# Altium project МЦТР.00010572.00.001.PrjPcb
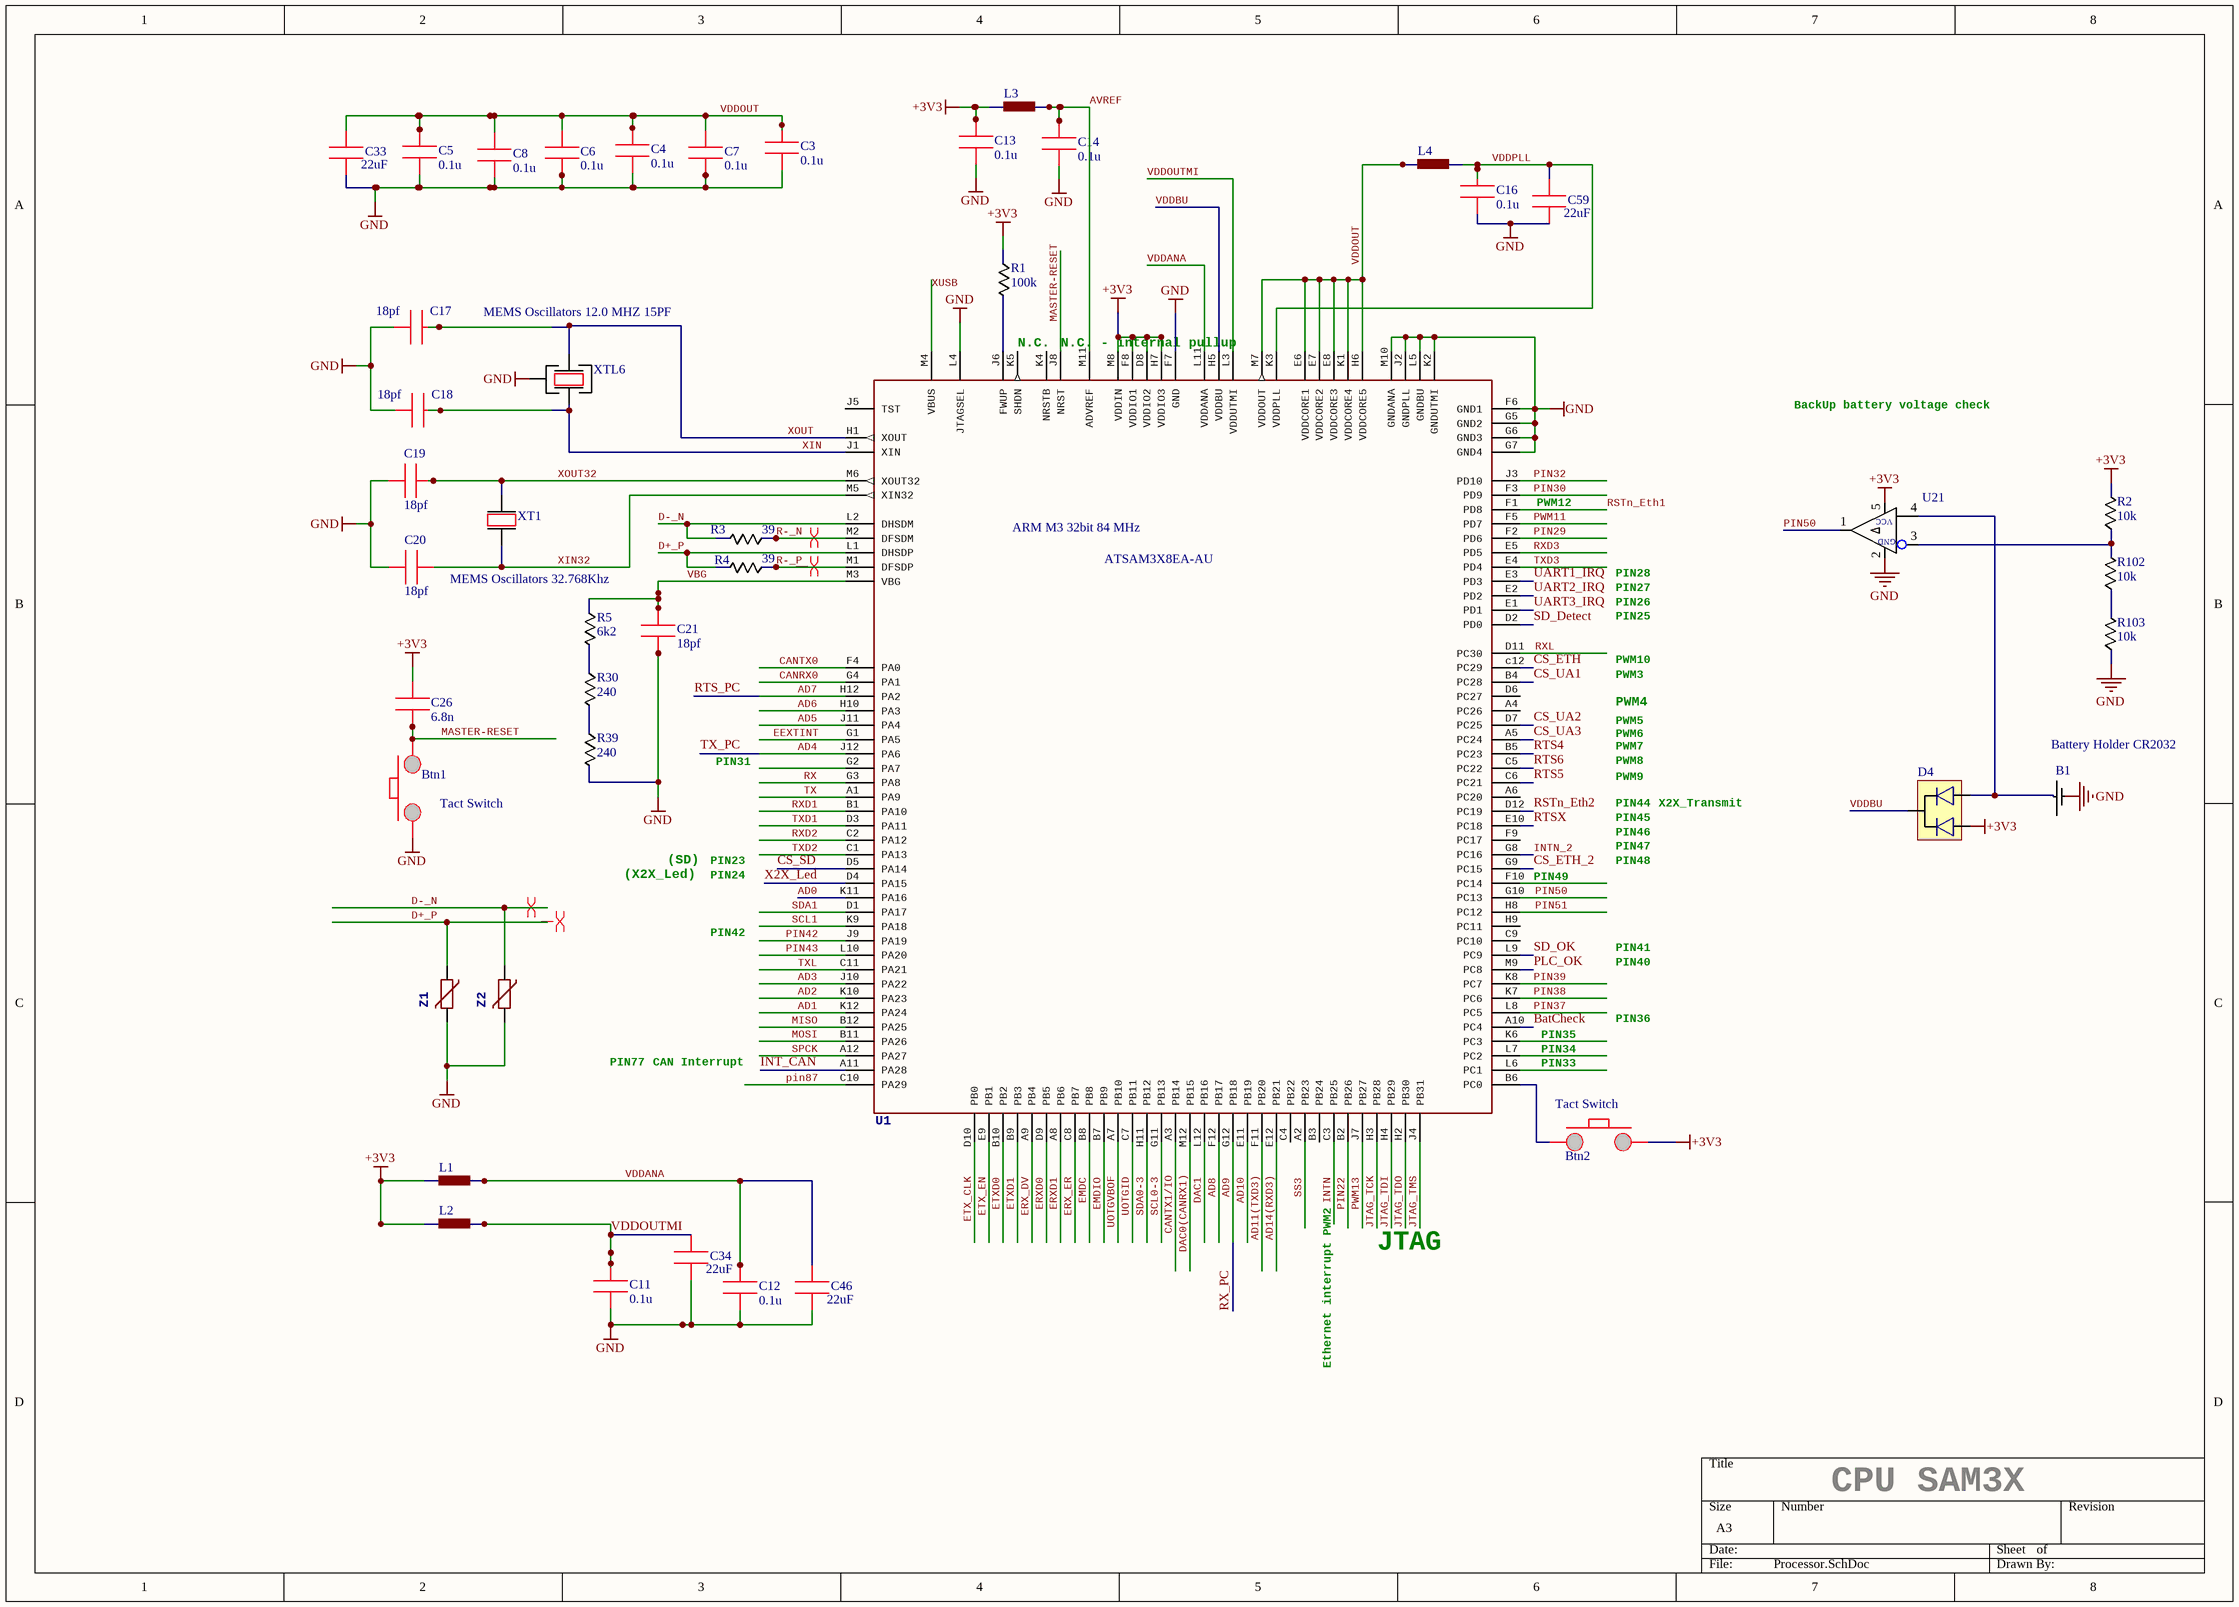
[diagram p0: Processor.SchDoc]
8 sheets, 286 parts. Net scope: global (net labels, ports and power ports of the same name join across sheets).
Board file: ÌÖÒÐ.00010572.00.001.PcbDoc
Sheets:
  Processor.SchDoc
  Power Supply.SchDoc
  LEDs.SchDoc
  Plugs.SchDoc
  Ethernet.SchDoc
  SD Holder.SchDoc
  RS485.SchDoc
  ETH_HMI.SchDoc

## Sheet Processor.SchDoc
size A3

### Parts
B1  Part Description: Battery Holder CR2032  [Batt Holder CR2032]
Btn1  (no value)  [Tact Switch]
Btn2  (no value)  [Tact Switch]
C3  0.1u  [0603]
C4  0.1u  [0603]
C5  0.1u  [0603]
C6  0.1u  [0603]
C7  0.1u  [0603]
C8  0.1u  [0603]
C11  0.1u  [0603]
C12  0.1u  [0603]
C13  0.1u  [0603]
C14  0.1u  [0603]
C16  0.1u  [0603]
C17  18pf  [0603]
C18  18pf  [0603]
C19  18pf  [0603]
C20  18pf  [0603]
C21  18pf  [0603]
C26  6.8n  [0603]
C33  22uF  [1206]
C34  22uF  [1206]
C46  22uF  [1206]
C59  22uF  [1206]
D4  (no value)  [SOT23]
L1  (no value)  [0805]
L2  (no value)  [0805]
L3  (no value)  [0805]
L4  (no value)  [0805]
R1  100k  [0603]
R2  10k  [0603]
R3  39  [0603]
R4  39  [0603]
R5  6k2  [0603]
R30  240  [0603]
R39  240  [0603]
R102  10k  [0603]
R103  10k  [0603]
U1  Part Description: ARM M3 32bit 84 MHz  Part Number: ATSAM3X8EA-AU  [LFBGA 144]
U21  (no value)  [SOT23 - 5 lead]
XT1  Part Description: MEMS Oscillators 32.768Khz  [KX – 327]
XTL6  Part Description: MEMS Oscillators 12.0 MHZ 15PF  [KX-7 XTAL]
Z1  (no value)  [0603]
Z2  (no value)  [0603]

### Nets
+3V3: Btn2.1 C13.2 C26.2 D4.1 L1.1 L2.1 L3.1 R1.1 R2.2 U1.D8(VDDIO2) U1.F8(VDDIO1) U1.H7(VDDIO3) U1.M8(VDDIN) U21.5
GND: B1.0 Btn1.0 C3.1 C4.1 C5.1 C6.1 C7.1 C8.1 C11.1 C12.1 C13.1 C14.1 C16.1 C17.1 C18.1 C19.2 C20.2 C21.1 C33.1 C34.1 C46.1 C59.1 R39.2 R103.1 U1.F6(GND1) U1.F7(GND) U1.G5(GND2) U1.G6(GND3) U1.G7(GND4) U1.J2(GNDPLL) U1.K2(GNDUTMI) U1.L4(JTAGSEL) U1.L5(GNDBU) U1.M10(GNDANA) U21.2 XTL6.2 Z1.2 Z2.2
AD0: U1.K11(PA16)
AD1: U1.K12(PA24)
AD2: U1.K10(PA23)
AD3: U1.J10(PA22)
AD4: U1.J12(PA6)  [also labelled TX_PC]
AD5: U1.J11(PA4)
AD6: U1.H10(PA3)
AD7: U1.H12(PA2)  [also labelled RTS_PC]
AD8: U1.F12(PB17)
AD9: U1.G12(PB18)  [also labelled RX_PC]
AD10: U1.E11(PB19)
AD11(TXD3): U1.F11(PB20)
AD14(RXD3): U1.E12(PB21)
AVREF: C14.2 L3.2 U1.M11(ADVREF)
BatCheck: U1.A10(PC4)
CANRX0: U1.G4(PA1)
CANTX0: U1.F4(PA0)
CANTX1/IO: U1.A3(PB14)
CS_ETH: U1.c12(PC29)
CS_ETH_2: U1.G9(PC15)
CS_SD: U1.D5(PA14)
CS_UA1: U1.B4(PC28)
CS_UA2: U1.D7(PC25)
CS_UA3: U1.A5(PC24)
D+_P: R4.2 U1.L1(DHSDP) Z1.1
D-_N: R3.2 U1.L2(DHSDM) Z2.1
DAC0(CANRX1): U1.M12(PB15)
DAC1: U1.L12(PB16)
EEXTINT: U1.G1(PA5)
EMDC: U1.B8(PB8)
EMDIO: U1.B7(PB9)
ERX_DV: U1.A9(PB4)
ERX_ER: U1.C8(PB7)
ERXD0: U1.D9(PB5)
ERXD1: U1.A8(PB6)
ETX_CLK: U1.D10(PB0)
ETX_EN: U1.E9(PB1)
ETXD0: U1.B10(PB2)
ETXD1: U1.B9(PB3)
INT_CAN: U1.A11(PA28)
INTN: U1.C3(PB25)
INTN_2: U1.G8(PC16)
JTAG_TCK: U1.H3(PB28)
JTAG_TDI: U1.H4(PB29)
JTAG_TDO: U1.H2(PB30)
JTAG_TMS: U1.J4(PB31)
MASTER-RESET: Btn1.1 C26.1 U1.J8(NRST)
MISO: U1.B12(PA25)
MOSI: U1.B11(PA26)
PIN22: U1.B2(PB26)
PIN29: U1.F2(PD6)
PIN30: U1.F3(PD9)
PIN32: U1.J3(PD10)
PIN37: U1.L8(PC5)
PIN38: U1.K7(PC6)
PIN39: U1.K8(PC7)
PIN42: U1.J9(PA19)
PIN43: U1.L10(PA20)
PIN50: U1.G10(PC13) U21.1
PIN51: U1.H8(PC12)
pin87: U1.C10(PA29)
PLC_OK: U1.M9(PC8)
PWM11: U1.F5(PD7)
PWM13: U1.J7(PB27)
R-_N: R3.1 U1.M2(DFSDM)
R-_P: R4.1 U1.M1(DFSDP)
RSTn_Eth1: U1.F1(PD8)
RSTn_Eth2: U1.D12(PC19)
RTS4: U1.B5(PC23)
RTS5: U1.C6(PC21)
RTS6: U1.C5(PC22)
RTSX: U1.E10(PC18)
RX: U1.G3(PA8)
RXD1: U1.B1(PA10)
RXD2: U1.C2(PA12)
RXD3: U1.E5(PD5)
RXL: U1.D11(PC30)
SCL0-3: U1.G11(PB13)
SCL1: U1.K9(PA18)
SD_Detect: U1.D2(PD0)
SD_OK: U1.L9(PC9)
SDA0-3: U1.H11(PB12)
SDA1: U1.D1(PA17)
SPCK: U1.A12(PA27)
SS3: U1.A2(PB23)
TX: U1.A1(PA9)
TXD1: U1.D3(PA11)
TXD2: U1.C1(PA13)
TXD3: U1.E4(PD4)
TXL: U1.C11(PA21)
UART1_IRQ: U1.E3(PD3)
UART2_IRQ: U1.E2(PD2)
UART3_IRQ: U1.E1(PD1)
UOTGID: U1.C7(PB11)
UOTGVBOF: U1.A7(PB10)
VBG: C21.2 R5.1 U1.M3(VBG)
VDDANA: C12.2 C46.2 L1.2 U1.L11(VDDANA)
VDDBU: D4.3 U1.H5(VDDBU)
VDDOUT: C3.2 C4.2 C5.2 C6.2 C7.2 C8.2 C33.2 L4.1 U1.E6(VDDCORE1) U1.E7(VDDCORE2) U1.E8(VDDCORE3) U1.H6(VDDCORE5) U1.K1(VDDCORE4) U1.M7(VDDOUT)
VDDOUTMI: C11.2 C34.2 L2.2 U1.L3(VDDUTMI)
VDDPLL: C16.2 C59.2 L4.2 U1.K3(VDDPLL)
X2X_Led: U1.D4(PA15)
XIN: C18.2 U1.J1(XIN) XTL6.3
XIN32: C20.1 U1.M5(XIN32) XT1.1
XOUT: C17.2 U1.H1(XOUT) XTL6.1
XOUT32: C19.1 U1.M6(XOUT32) XT1.2
XUSB: U1.M4(VBUS)
NetB1_1: B1.1 D4.2 U21.4
NetBtn2_0: Btn2.0 U1.B6(PC0)
NetR1_2: R1.2 U1.J6(FWUP)
NetR2_1: R2.1 R102.2 U21.3
NetR5_2: R5.2 R30.1
NetR30_2: R30.2 R39.1
NetR102_1: R102.1 R103.2

Not connected (* = marked no-connect by the designer): U1 A4(PC26) A6(PC20) B3(PB24) C4(PB22) C9(PC10) D6(PC27) F9(PC17) F10(PC14) G2(PA7) H9(PC11) J5(TST) K4(NRSTB) K5(SHDN) K6(PC3) L6(PC1) L7(PC2)

### Layout directives
differential pair: (no net found under the mark)

### Notes on the sheet
- N.C.
- (near U1) N.C. - internal pullup
- BackUp battery voltage check
- (near U1) PWM12
- PIN28
- PIN27
- PIN26
- PIN25
- PWM3
- PWM10
- PIN31
- PWM5
- PWM6
- PWM7
- PWM8
- PWM4
- PWM9
- PIN44
- PIN46
- PIN45
- X2X_Transmit
- (X2X_Led)
- (SD)
- PIN23
- PIN24
- (near U1) PIN49
- PIN47
- PIN48
- PIN42
- PIN41
- PIN40
- (near U1) PIN35
- (near U1) PIN34
- PIN36
- PIN77
- CAN Interrupt
- PIN33
- PWM2
- JTAG
- Ethernet interrupt
- CPU SAM3X
- (in symbol TS391ILT) VCC; GND

### Library data of the parts
B1 = Batt Holder CR2032: Part Number: 1734178-1
Btn1 Btn2 = Tact Switch: Part Number: KLS7-TS6606-4.3-180; Part Description: Tact Switch
C3-C8 C11-C14 C16 = Capasitor 0805: Part Description: 0.1 uF 100 VDC 10% 0603 X7R; Part Number: GRM188R72A104KA35D
C17-C21 = Capasitor 0805: Part Description: 18 pF 50 VDC 5% 0603 C0G; Part Number: GRM1885C1H180JA01D
C26 = 0603 CAP: Part Description: 50V 6800pF X7R 0603 10%; Part Number: CC0603KRX7R9BB682
C33 C34 C46 C59 = 0805 Cap: Part Description: 16V 22uF X5R 1206; Part Number: CC1206KKX5R7BB226
D4 = BAT54C: Part Description: Schottky Diodes & Rectifiers Schottky, SOT-23, 30V, 0.2A; Part Number: BAT54C
L1-L4 = BLM21PG220SN1D: Part Description: Ferrite Beads 1000 OHM 25%  100 MHz; Part Number: BLM41PG102SN1L
R1 = Resistor 0805: Part Description: Resistor 0603, 100kOhms, 1%, 1/10W; Part Number: RC0603FR-07100KL
R2 R102 R103 = Resistor 0805: Part Description: Resistor 0603, 10kOhms, 5%, 1/10W; Part Number: RC0603JR-0710K
R3 R4 = Resistor 0805: Part Description: Resistor 0603, 39Ohms, 1%, 1/10W; Part Number: RC0603FR-0739RL
R5 = Resistor 0805: Part Description: Resistor 0603, 6.2kOhms, 5%, 1/10W; Part Number: RC0603JR-076K2L
R30 R39 = Resistor 0805: Part Description: Resistor 0603, 240Ohms, 1%, 1/10W; Part Number: RC0603FR-07240RL
U1 = ATSAM3X/AAU
U21 = TS391ILT: Part Description: Analog Comparators Lo-Pwr Sngl Voltage; Part Number: TS391ILT
XT1 = KX – 327XS: Part Number: KX – 327XS
XTL6 = KX-7: Part Number: Geyer KX-7 12.0 MHz
Z1 Z2 = VARISTORCN0603: Part Description: Chip Guard 0603 5 Volts; Part Number: CG0603MLC-05E

## Sheet Power Supply.SchDoc
size A4
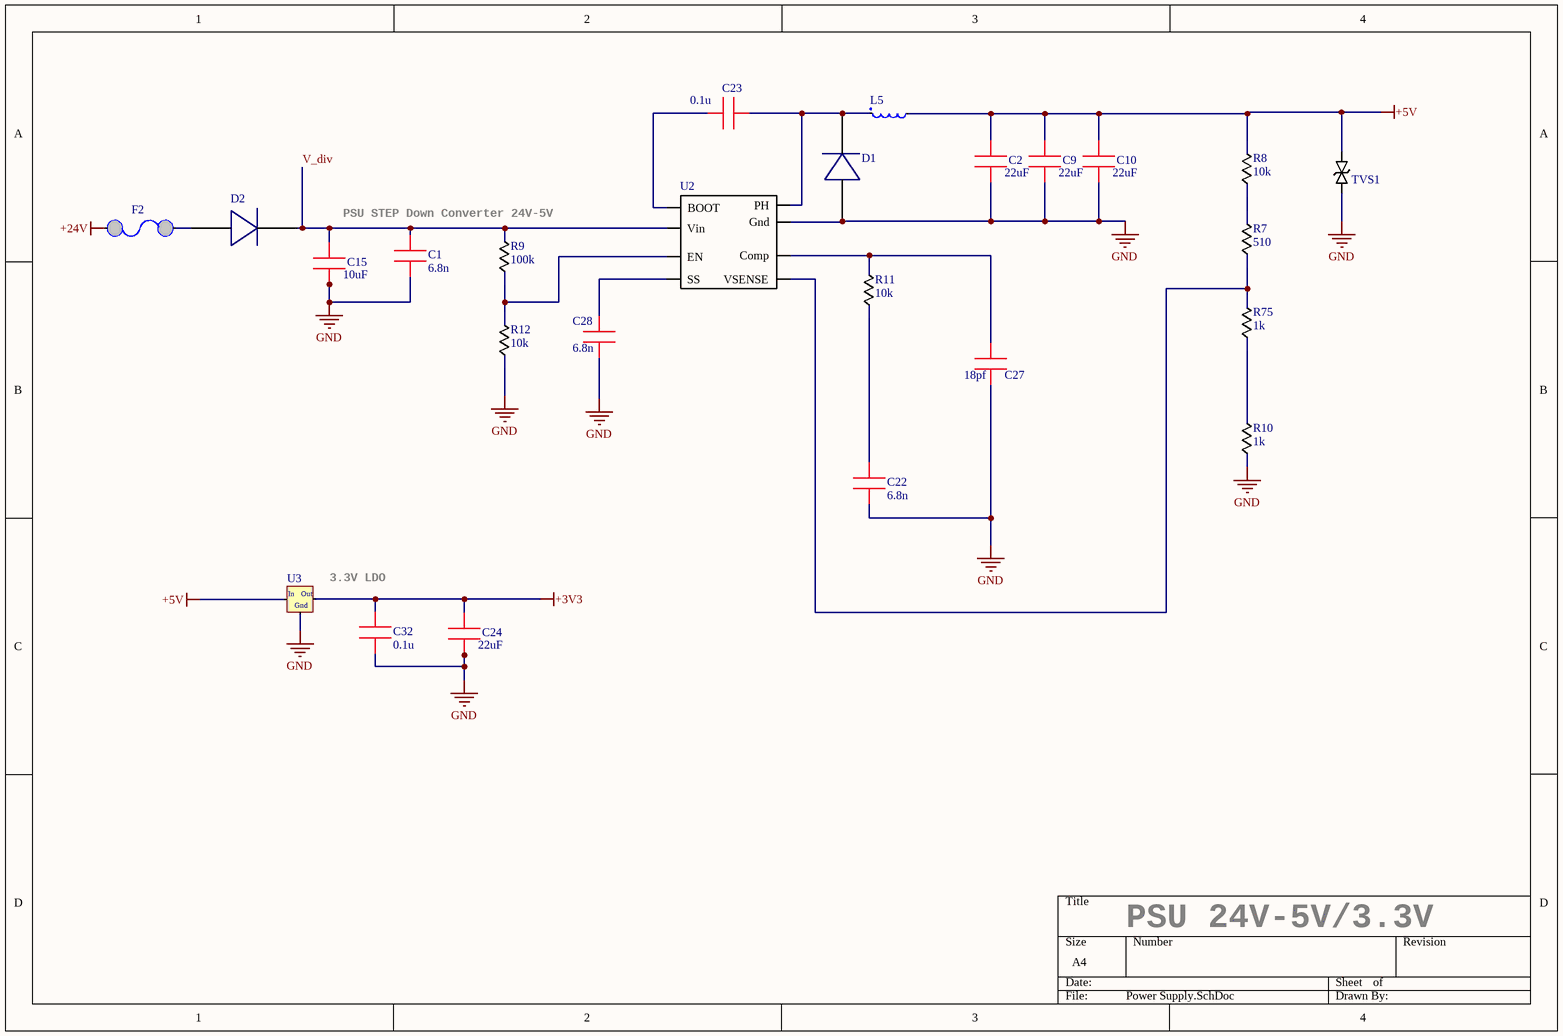
[diagram p1: Power Supply.SchDoc]

### Parts
C1  6.8n  [0603]
C2  22uF  [1206]
C9  22uF  [1206]
C10  22uF  [1206]
C15  10uF  [1206]
C22  6.8n  [0603]
C23  0.1u  [0603]
C24  22uF  [1206]
C27  18pf  [0603]
C28  6.8n  [0603]
C32  0.1u  [0603]
D1  (no value)  [B340A-13-F]
D2  (no value)  [B340A-13-F]
F2  (no value)  [Fuse PTS]
L5  (no value)  [CDRH127/LDNP-270MC,]
R7  510  [0603]
R8  10k  [0603]
R9  100k  [0603]
R10  1k  [0603]
R11  10k  [0603]
R12  10k  [0603]
R75  1k  [0603]
TVS1  (no value)  [DO-214AC]
U2  (no value)  [SOIC 8]
U3  (no value)  [SOT223]

### Nets
+3V3: C24.2 C32.1 U3.2(OUT)
+5V: C2.2 C9.2 C10.2 L5.2 R8.2 TVS1.2 U3.3(IN)
+24V: F2.2
GND: C1.1 C2.1 C9.1 C10.1 C15.1 C22.1 C24.1 C27.1 C28.1 C32.2 D1.2 R10.1 R12.1 TVS1.1 U2.7(Gnd) U3.1(GND)
V_div: C1.2 C15.2 D2.1 R9.2 U2.2(Vin)
NetC22_2: C22.2 R11.1
NetC23_1: C23.1 U2.1(BOOT)
NetC23_2: C23.2 D1.1 L5.1 U2.8(PH)
NetC27_2: C27.2 R11.2 U2.6(Comp)
NetC28_2: C28.2 U2.4(SS)
NetD2_2: D2.2 F2.1
NetR7_1: R7.1 R75.2 U2.5(VSENSE)
NetR7_2: R7.2 R8.1
NetR9_1: R9.1 R12.2 U2.3(EN)
NetR10_2: R10.2 R75.1

### Notes on the sheet
- PSU STEP Down Converter 24V-5V
- (near U3) 3.3V LDO
- PSU 24V-5V/3.3V
- (in symbol NCV1117ST50T3G) In; Out; Gnd

### Library data of the parts
C1 C22 = 0603 CAP: as C26 on sheet Processor
C2 C9 C10 C24 = 0805 Cap: as C33 on sheet Processor
C15 = 0805 Cap: Part Description: 10UF 50V 10% 1206; Part Number: GRM31CR61H106KA12L
C23 = 0805 Cap: Part Description: 0.1 uF 100 VDC 10% 0603 X7R; Part Number: GRM188R72A104KA35D
C27 = 0805 Cap: Part Description: 18 pF 50 VDC 5% 0603 C0G; Part Number: GRM1885C1H180JA01D
C28 = 0805 Cap: Part Description: 50V 6800pF X7R 0603 10%; Part Number: CC0603KRX7R9BB682
C32 = Capasitor 0805: as C3 on sheet Processor
D1 D2 = B340A-13-F: Part Description: Schottky Diodes & Rectifiers 60V 3A; Part Number: B360A-13-F
F2 = Fuse PTS: Part Description: PPTC 30V 300MA; Part Number: MF-MSMF030-2
L5 = CDRH127/LDNP-270MC: Part Description: Power Inductors - SMD 22uH 4.7A; Part Number: CDRH127/LDNP-220MC
R7 = Resistor 0805: Part Description: Resistor 0603, 510Ohms, 5%, 1/10W; Part Number: RC0603JR-07510RL
R8 R11 R12 = Resistor 0805: as R2 on sheet Processor
R9 = 0603 RES: Part Description: Resistor 0603, 100kOhms, 1%, 1/10W; Part Number: RC0603FR-07100KL
R10 R75 = Resistor 0805: Part Description: Resistor 0603, 1kOhms, 5%, 1/10W; Part Number: RC0603JR-071KL
TVS1 = TVS: Part Number: SMAJ5.0CA; Part Description: ESD Protection Diodes 5V
U2 = TPS54331: Part Description: Switching Voltage Regulators 3A 28V In Step Down; Part Number: TPS54331DR
U3 = NCV1117ST50T3G: Part Description: LDO Voltage Regulators 800MA 3.3V; Part Number: LM1117MPX-3.3

## Sheet LEDs.SchDoc
size A4
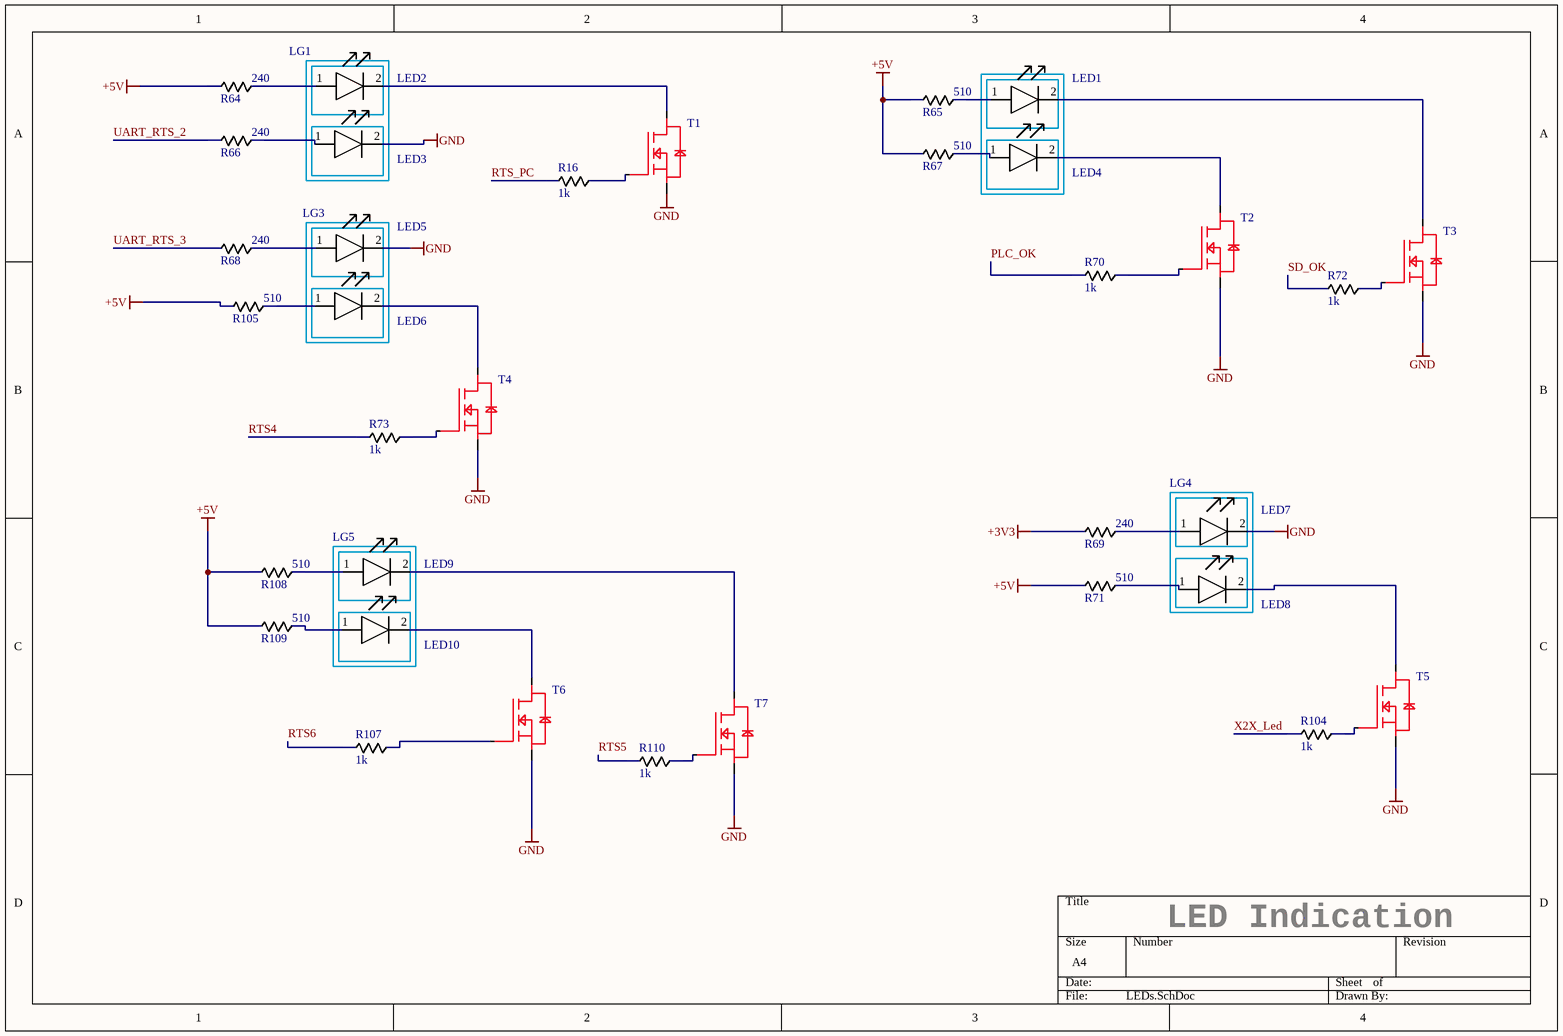
[diagram p2: LEDs.SchDoc]

### Parts
LED1  (no value)  [0603 - LED]
LED2  (no value)  [0603 - LED]
LED3  (no value)  [0603 - LED]
LED4  (no value)  [0603 - LED]
LED5  (no value)  [0603 - LED]
LED6  (no value)  [0603 - LED]
LED7  (no value)  [0603 - LED]
LED8  (no value)  [0603 - LED]
LED9  (no value)  [0603 - LED]
LED10  (no value)  [0603 - LED]
LG1  (no value)  [LED SMD DayLight]
LG2  (no value)  [LED SMD DayLight]
LG3  1k  [LED SMD DayLight]  (value not drawn)
LG4  (no value)  [LED SMD DayLight]
LG5  (no value)  [LED SMD DayLight]
R16  1k  [0603]
R64  240  [0603]
R65  510  [0603]
R66  240  [0603]
R67  510  [0603]
R68  240  [0603]
R69  240  [0603]
R70  1k  [0603]
R71  510  [0603]
R72  1k  [0603]
R73  1k  [0603]
R104  1k  [0603]
R105  510  [0603]
R107  1k  [0603]
R108  510  [0603]
R109  510  [0603]
R110  1k  [0603]
T1  (no value)  [SOT23]
T2  (no value)  [SOT23]
T3  (no value)  [SOT23]
T4  (no value)  [SOT23]
T5  (no value)  [SOT23]
T6  (no value)  [SOT23]
T7  (no value)  [SOT23]

### Nets
+3V3: R69.2
+5V: R64.2 R65.2 R67.2 R71.2 R105.2 R108.2 R109.2
GND: LED3.2 LED5.2 LED7.2 T1.2 T2.2 T3.2 T4.2 T5.2 T6.2 T7.2
PLC_OK: R70.2
RTS4: R73.2
RTS5: R110.2
RTS6: R107.2
RTS_PC: R16.2  [project net AD7]
SD_OK: R72.2
UART_RTS_2: R66.2
UART_RTS_3: R68.2
X2X_Led: R104.2
NetLED1_1: LED1.1 R65.1
NetLED1_2: LED1.2 T3.3
NetLED2_1: LED2.1 R64.1
NetLED2_2: LED2.2 T1.3
NetLED3_1: LED3.1 R66.1
NetLED4_1: LED4.1 R67.1
NetLED4_2: LED4.2 T2.3
NetLED5_1: LED5.1 R68.1
NetLED6_1: LED6.1 R105.1
NetLED6_2: LED6.2 T4.3
NetLED7_1: LED7.1 R69.1
NetLED8_1: LED8.1 R71.1
NetLED8_2: LED8.2 T5.3
NetLED9_1: LED9.1 R108.1
NetLED9_2: LED9.2 T7.3
NetLED10_1: LED10.1 R109.1
NetLED10_2: LED10.2 T6.3
NetR16_1: R16.1 T1.1
NetR70_1: R70.1 T2.1
NetR72_1: R72.1 T3.1
NetR73_1: R73.1 T4.1
NetR104_1: R104.1 T5.1
NetR107_1: R107.1 T6.1
NetR110_1: R110.1 T7.1

### Notes on the sheet
- LED Indication

### Library data of the parts
LED1 LED4 LED7 LED8 = LED 0603: Part Number: KP-1608SGC; Part Description: 0603 Single Colour LED Green
LED2 LED3 LED5 LED6 LED9 LED10 = LED 0603: Part Number: KP-1608SYC; Part Description: 0603 Single Colour LED Yellow
LG1 LG2 LG4 LG5 = Light Guide 2: Part Number: 5151094F; Part Description: Light Guide
LG3 = Light Guide 2: Part Number: RC0603FR-071KL; Part Description: Thick Film Resistor - 0603, 1kOhms, 1%, 1/10W
R16 R70 R72 R73 R104 R107 R110 = Resistor 0805: as R10 on sheet Power Supply
R64 R66 R68 R69 = Resistor 0805: as R30 on sheet Processor
R65 R67 R71 R105 R108 R109 = Resistor 0805: as R7 on sheet Power Supply
T1-T7 = IRLML2402: Part Description: MOSFETs SOT-23 N-CH LOGIC; Part Number: BSS138

## Sheet Plugs.SchDoc
size A4
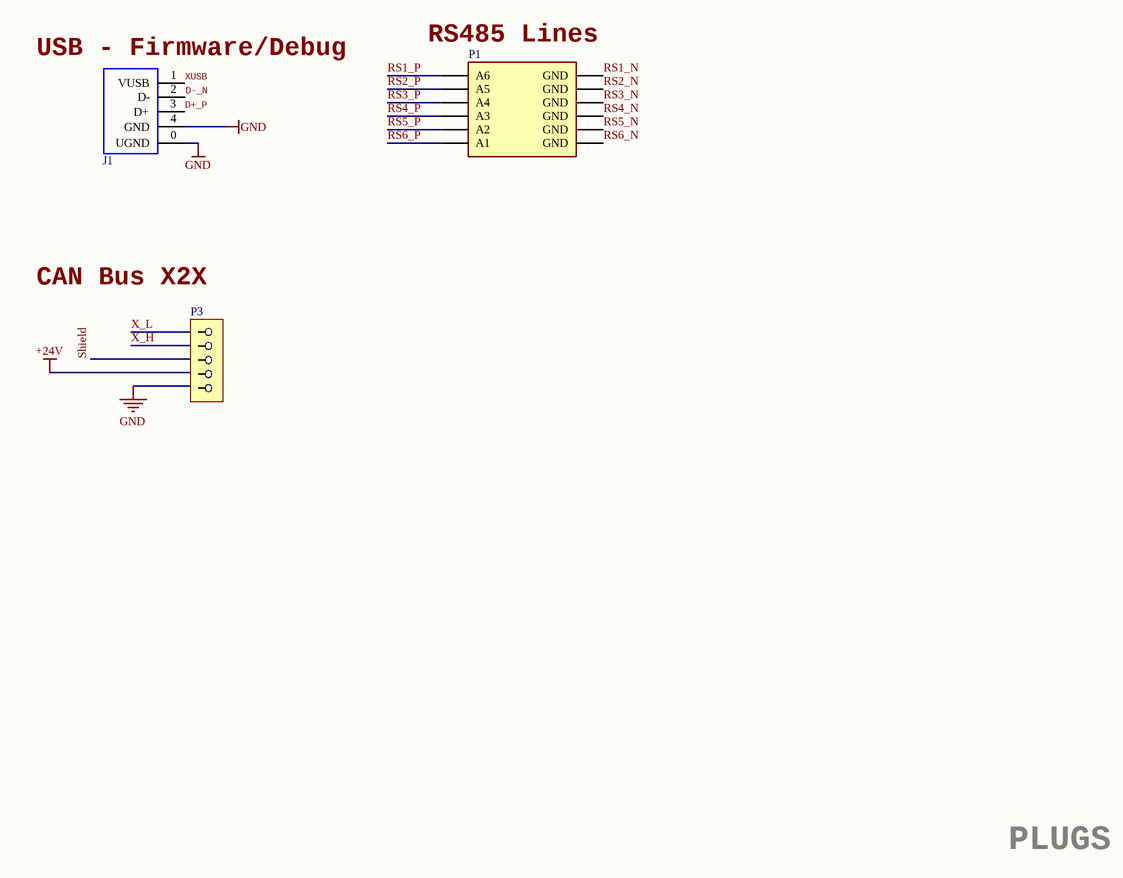
[diagram p3: Plugs.SchDoc]

### Parts
J1  (no value)  [USB B]
P1  (no value)  [mcd 1,5/6-G1-3.81]
P3  (no value)  [PhClass5]

### Nets
+24V: P3.4
GND: J1.0(UGND) J1.4(GND) P3.5
D+_P: J1.3(D+)
D-_N: J1.2(D-)
RS1_N: P1.2(GND)
RS1_P: P1.1(A6)
RS2_N: P1.4(GND)
RS2_P: P1.3(A5)
RS3_N: P1.6(GND)
RS3_P: P1.5(A4)
RS4_N: P1.8(GND)
RS4_P: P1.7(A3)
RS5_N: P1.10(GND)
RS5_P: P1.9(A2)
RS6_N: P1.12(GND)
RS6_P: P1.11(A1)
Shield: P3.3
X_H: P3.2
X_L: P3.1
XUSB: J1.1(VUSB)

### Notes on the sheet
- (near J1) USB - Firmware/Debug
- (near P1) RS485 Lines
- (near P3) CAN Bus X2X
- PLUGS

### Library data of the parts
J1 = USBB-1J: Part Description: USB B Socket; Part Number: USBB-1J
P1 = Header 6X2: Part Description: PCB Header, 6-Pin, Dual row; Part Number: MCD 1.5/6-G1-3.81
P3 = EMSTBA 2.5/5-G-5.08: Part Description: PCB header; Part Number: EMSTBA 2.5/5-G-5.08

## Sheet Ethernet.SchDoc
size A3
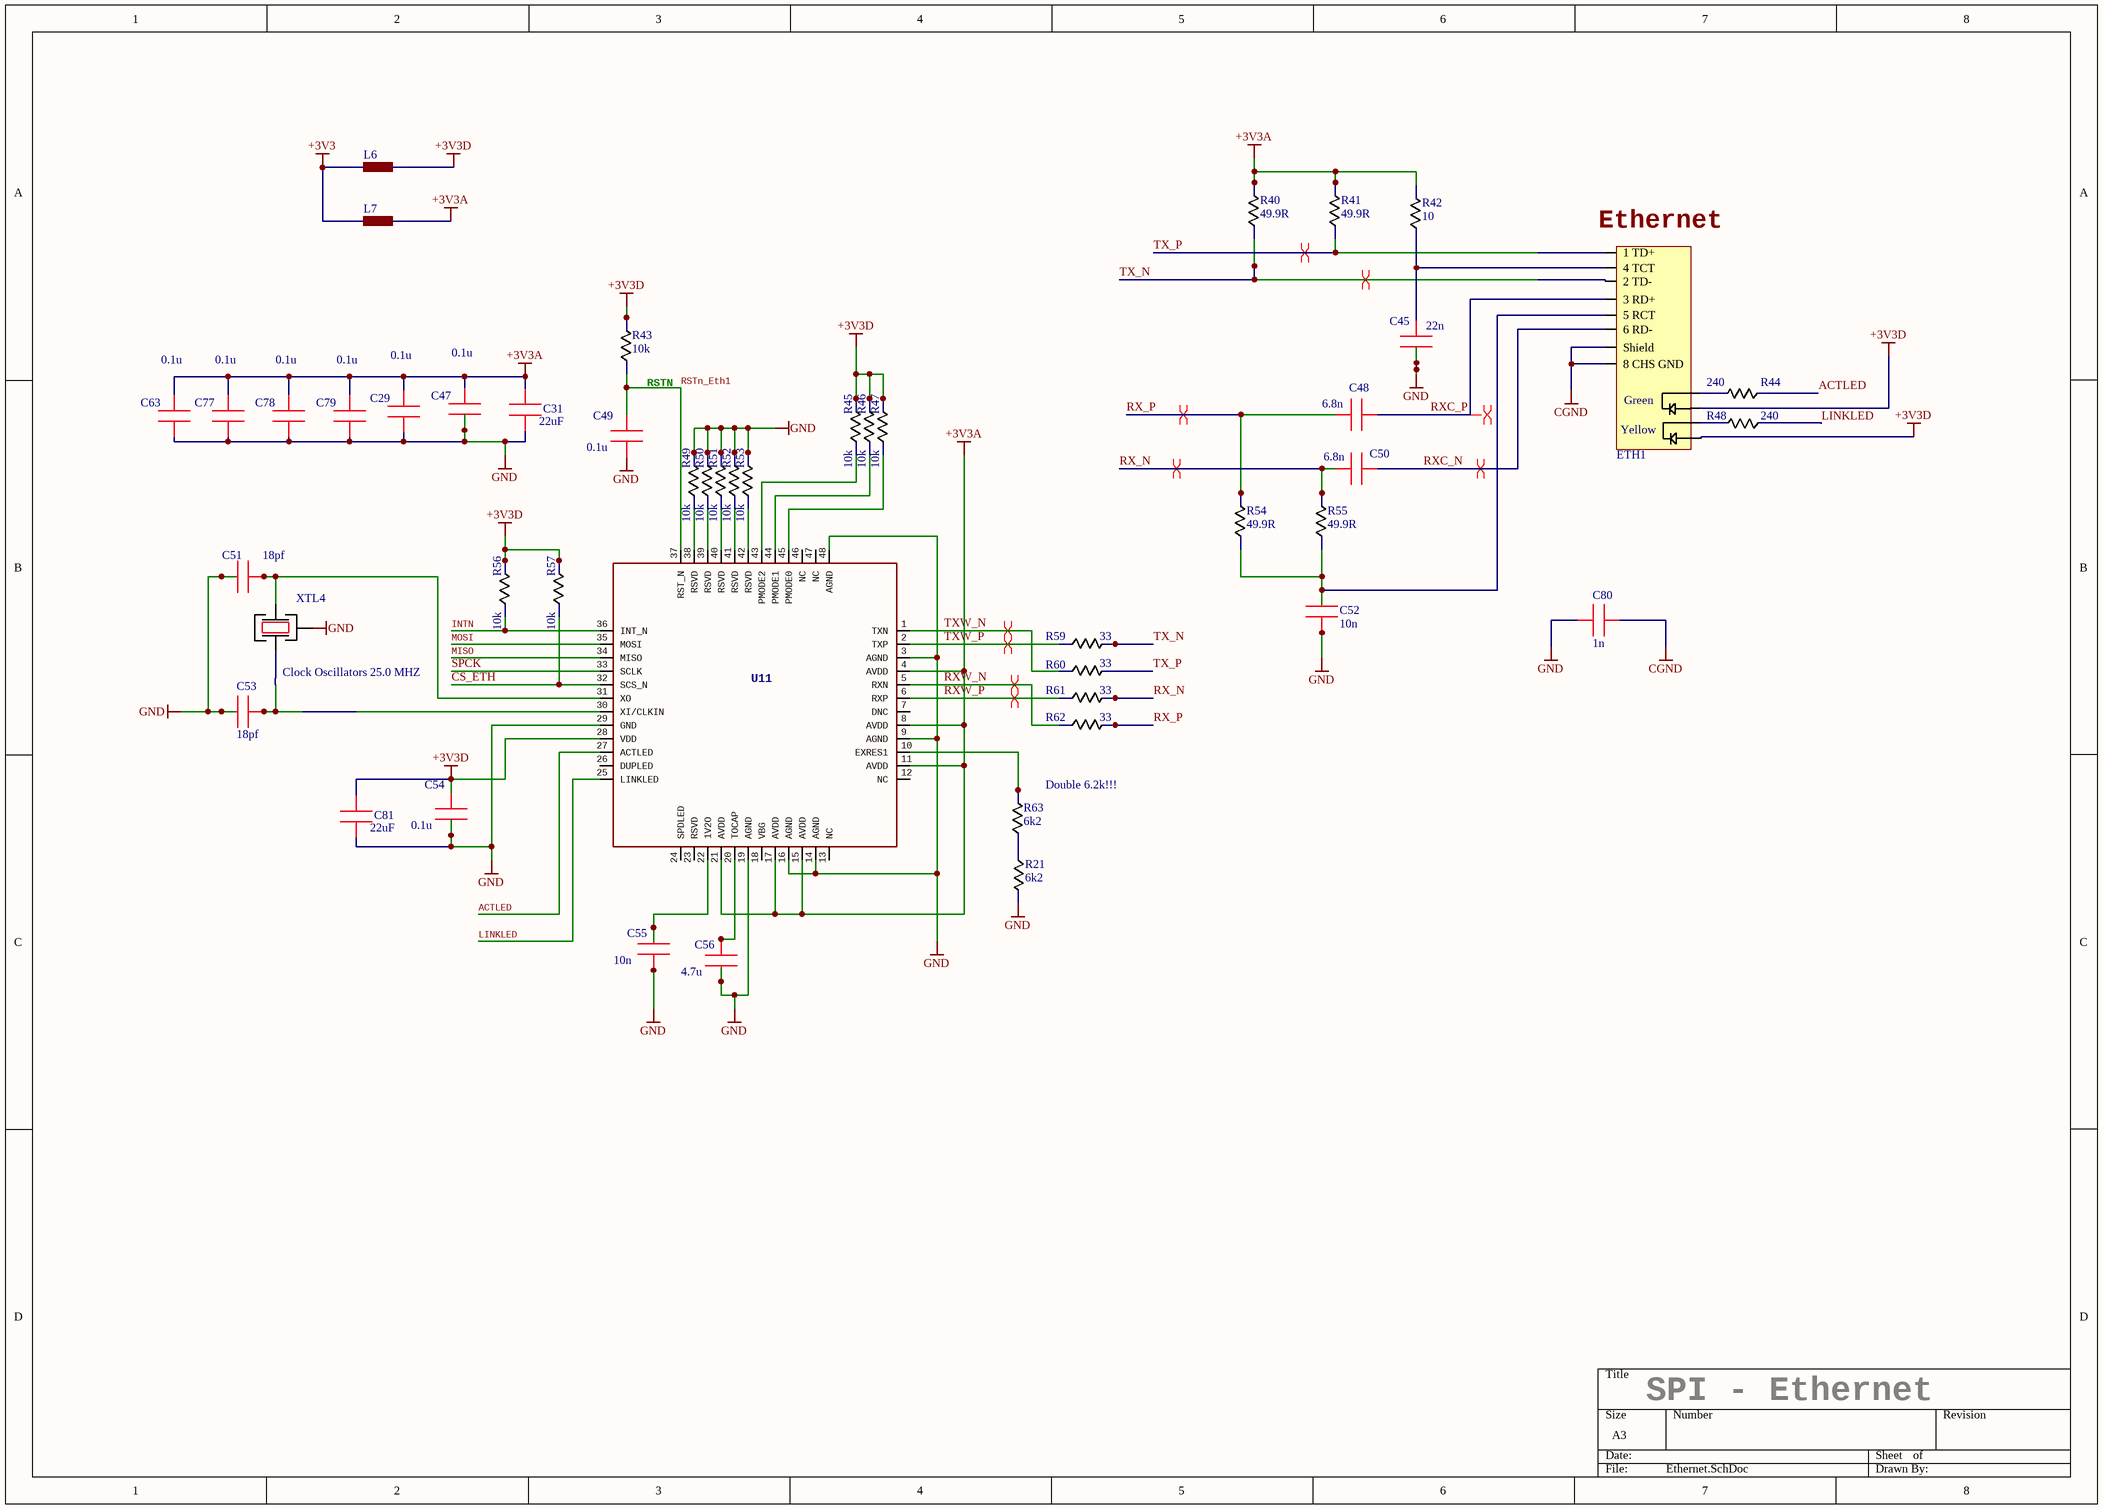
[diagram p4: Ethernet.SchDoc]

### Parts
C29  0.1u  [0603]
C31  22uF  [1206]
C45  22n  [0603]
C47  0.1u  [0603]
C48  6.8n  [0603]
C49  0.1u  [0603]
C50  6.8n  [0603]
C51  18pf  [0603]
C52  10n  [0603]
C53  18pf  [0603]
C54  0.1u  [0603]
C55  10n  [0603]
C56  4.7u  [0603]
C63  0.1u  [0603]
C77  0.1u  [0603]
C78  0.1u  [0603]
C79  0.1u  [0603]
C80  1n  [1206]
C81  22uF  [1206]
ETH1  (no value)  [RJ45]
L6  (no value)  [0805]
L7  (no value)  [0805]
R21  6k2  [0603]
R40  49.9R  [0603]
R41  49.9R  [0603]
R42  10  [0603]
R43  10k  [0603]
R44  240  [0603]
R45  10k  [0603]
R46  10k  [0603]
R47  10k  [0603]
R48  240  [0603]
R49  10k  [0603]
R50  10k  [0603]
R51  10k  [0603]
R52  10k  [0603]
R53  10k  [0603]
R54  49.9R  [0603]
R55  49.9R  [0603]
R56  10k  [0603]
R57  10k  [0603]
R59  33  [0603]
R60  33  [0603]
R61  33  [0603]
R62  33  [0603]
R63  6k2  [0603]
U11  (no value)  [LQFP 48]
XTL4  Part Description: Clock Oscillators 25.0 MHZ  [KX-7 XTAL]

### Nets
+3V3: L6.1 L7.1
+3V3A: C29.1 C31.2 C47.1 C63.1 C77.1 C78.1 C79.1 L7.2 R40.2 R41.2 R42.2 U11.4(AVDD) U11.8(AVDD) U11.11(AVDD) U11.15(AVDD) U11.17(AVDD) U11.21(AVDD)
+3V3D: C54.1 C81.2 ETH1.9(LDGr) ETH1.12(LDYE) L6.2 R43.2 R45.2 R46.2 R47.2 R56.2 R57.2 U11.28(VDD)
CGND: C80.2 ETH1.8(8_CHS_GND) ETH1.SHIELD(Shield)
GND: C29.2 C31.1 C45.2 C47.2 C49.2 C51.1 C52.2 C53.1 C54.2 C55.2 C56.2 C63.2 C77.2 C78.2 C79.2 C80.1 C81.1 R21.2 R49.2 R50.2 R51.2 R52.2 R53.2 U11.3(AGND) U11.9(AGND) U11.14(AGND) U11.16(AGND) U11.19(AGND) U11.29(GND) U11.48(AGND) XTL4.2
ACTLED: R44.1 U11.27(ACTLED)
CS_ETH: R57.1 U11.32(SCS_N)
INTN: R56.1 U11.36(INT_N)
LINKLED: R48.1 U11.25(LINKLED)
MISO: U11.34(MISO)
MOSI: U11.35(MOSI)
RSTn_Eth1: C49.1 R43.1 U11.37(RST_N)
RX_N: C50.1 R55.2 R61.2
RX_P: C48.1 R54.2 R62.2
RXC_N: C50.2 ETH1.6(6_RD-)
RXC_P: C48.2 ETH1.3(3_RD+)
RXW_N: R62.1 U11.5(RXN)
RXW_P: R61.1 U11.6(RXP)
SPCK: U11.33(SCLK)
TX_N: ETH1.2(2_TD-) R40.1 R59.2
TX_P: ETH1.1(1_TD+) R41.1 R60.2
TXW_N: R60.1 U11.1(TXN)
TXW_P: R59.1 U11.2(TXP)
NetC45_1: C45.1 ETH1.4(4_TCT) R42.1
NetC51_2: C51.2 U11.31(XO) XTL4.3
NetC52_1: C52.1 ETH1.5(5_RCT) R54.1 R55.1
NetC53_2: C53.2 U11.30(XI/CLKIN) XTL4.1
NetC55_1: C55.1 U11.22(1V2O)
NetC56_1: C56.1 U11.20(TOCAP)
NetETH1_10: ETH1.10(LDGr) R44.2
NetETH1_11: ETH1.11(LDYE) R48.2
NetR21_1: R21.1 R63.1
NetR45_1: R45.1 U11.43(PMODE2)
NetR46_1: R46.1 U11.44(PMODE1)
NetR47_1: R47.1 U11.45(PMODE0)
NetR49_1: R49.1 U11.38(RSVD)
NetR50_1: R50.1 U11.39(RSVD)
NetR51_1: R51.1 U11.40(RSVD)
NetR52_1: R52.1 U11.41(RSVD)
NetR53_1: R53.1 U11.42(RSVD)
NetR63_2: R63.2 U11.10(EXRES1)

Not connected (* = marked no-connect by the designer): U11 7(DNC) 12(NC) 13(NC) 18(VBG) 23(RSVD) 24(SPDLED) 26(DUPLED) 46(NC) 47(NC)

### Layout directives
differential pair: RX_N, RX_P, RXC_N, RXC_P, RXW_N, RXW_P, TX_N, TX_P, TXW_N, TXW_P

### Notes on the sheet
- (near ETH1) Ethernet
- (near R43) RSTN
- (near R63) Double 6.2k!!!
- SPI - Ethernet
- (in symbol J0011D21BNL) Green; Yellow

### Library data of the parts
C29 C47 C49 C54 C63 C77-C79 = 0603 CAP: Part Description: 0.1 uF 100 VDC 10% 0603 X7R; Part Number: GRM188R72A104KA35D
C31 C81 = 0805 Cap: Part Description: 16V 22uF X5R 1206 10%; Part Number: CC1206KKX5R7BB226
C45 = 0603 CAP: Part Description: 0.022UF 50V 10% 0603; Part Number: GRM188R71H223KA01D
C48 C50 = 0603 CAP: as C26 on sheet Processor
C51 C53 = 0603 CAP: Part Description: 18 pF 50 VDC 5% 0603 C0G; Part Number: GRM1885C1H180JA01D
C52 C55 = 0603 CAP: Part Description: 50V 0.01uF X7R 0603 5%; Part Number: CC0603JRX7R9BB103
C56 = 0603 CAP: Part Description: 16V 4.7uF X5R 0603 10%; Part Number: CC0603KRX5R7BB475
C80 = 0603 CAP: Part Description: 2kV 1000pF X7R 1206 10%; Part Number: CC1206KKX7RDBB102
ETH1 = J0011D21BNL: Part Description: RJ45 MagJack; Part Number: J0011D21BNL
L6 L7 = BLM21PG220SN1D: as L1 on sheet Processor
R21 = Resistor 0805: as R5 on sheet Processor
R40 R41 R54 R55 = 0603 RES: Part Description: Resistor 0603, 49.9Ohms, 1%, 1/10W; Part Number: RC0603FR-0749R9
R42 = 0603 RES: Part Description: Resistors - 1/8 Watt 10ohms 1%; Part Number: CRCW060310R0FKEA
R43 R45-R47 R49-R53 R56 R57 = 0603 RES: Part Description: Resistor 0603, 10kOhms, 5%, 1/10W; Part Number: RC0603JR-0710K
R44 R48 = 0603 RES: Part Description: Resistor 0603, 240Ohms, 1%, 1/10W; Part Number: RC0603FR-07240RL
R59-R62 = 0603 RES: Part Description: Resistor 0603, 33Ohms, 1%, 1/10W; Part Number: RC0603FR-0733RL
R63 = 0603 RES: Part Description: Resistor 0603, 6.2kOhms, 5%, 1/10W; Part Number: RC0603JR-076K2L
U11 = W5500: Part Description: Ethernet ICs 3in1 Enet Controller TCP/IP +MAC+PHY; Part Number: W5500
XTL4 = KX-7: Part Number: Geyer KX-7 25.0 MHz

## Sheet SD Holder.SchDoc
size A4
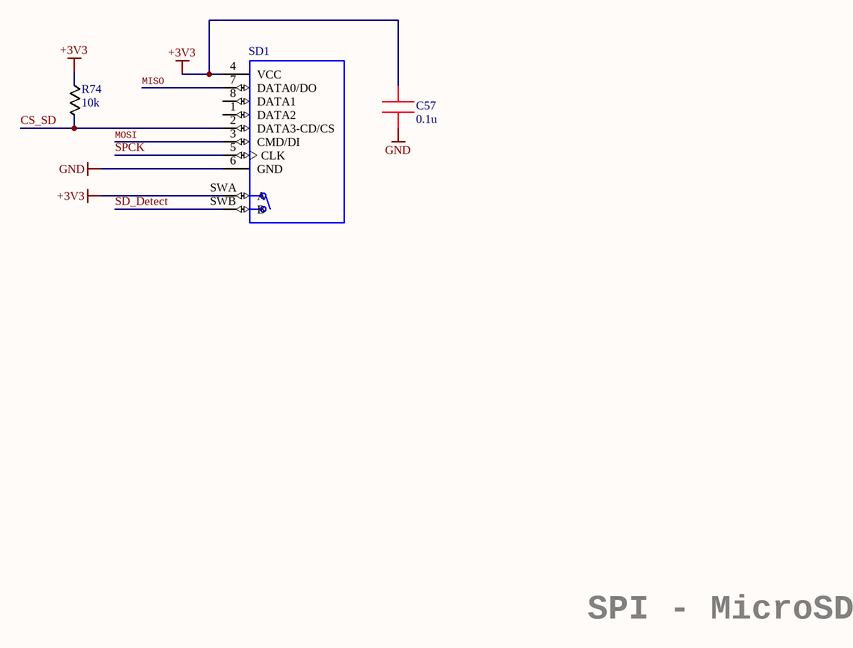
[diagram p5: SD Holder.SchDoc]

### Parts
C57  0.1u  [0603]
R74  10k  [0603]
SD1  (no value)  [DM3AT-SF-PEJM5]

### Nets
+3V3: C57.2 R74.1 SD1.4(VCC) SD1.SWA(A)
GND: C57.1 SD1.6(GND)
CS_SD: R74.2 SD1.2(DATA3-CD/CS)
MISO: SD1.7(DATA0/DO)
MOSI: SD1.3(CMD/DI)
SD_Detect: SD1.SWB(B)
SPCK: SD1.5(CLK)

Not connected (* = marked no-connect by the designer): SD1 1(DATA2) 8(DATA1)

### Notes on the sheet
- SPI - MicroSD

### Library data of the parts
C57 = 0603 CAP: as C29 on sheet Ethernet
R74 = 0603 RES: as R43 on sheet Ethernet
SD1 = DM3AT-SF-PEJM5: Part Description: uSD card holder; Part Number: DM3AT-SF-PEJM5

## Sheet RS485.SchDoc
size A3
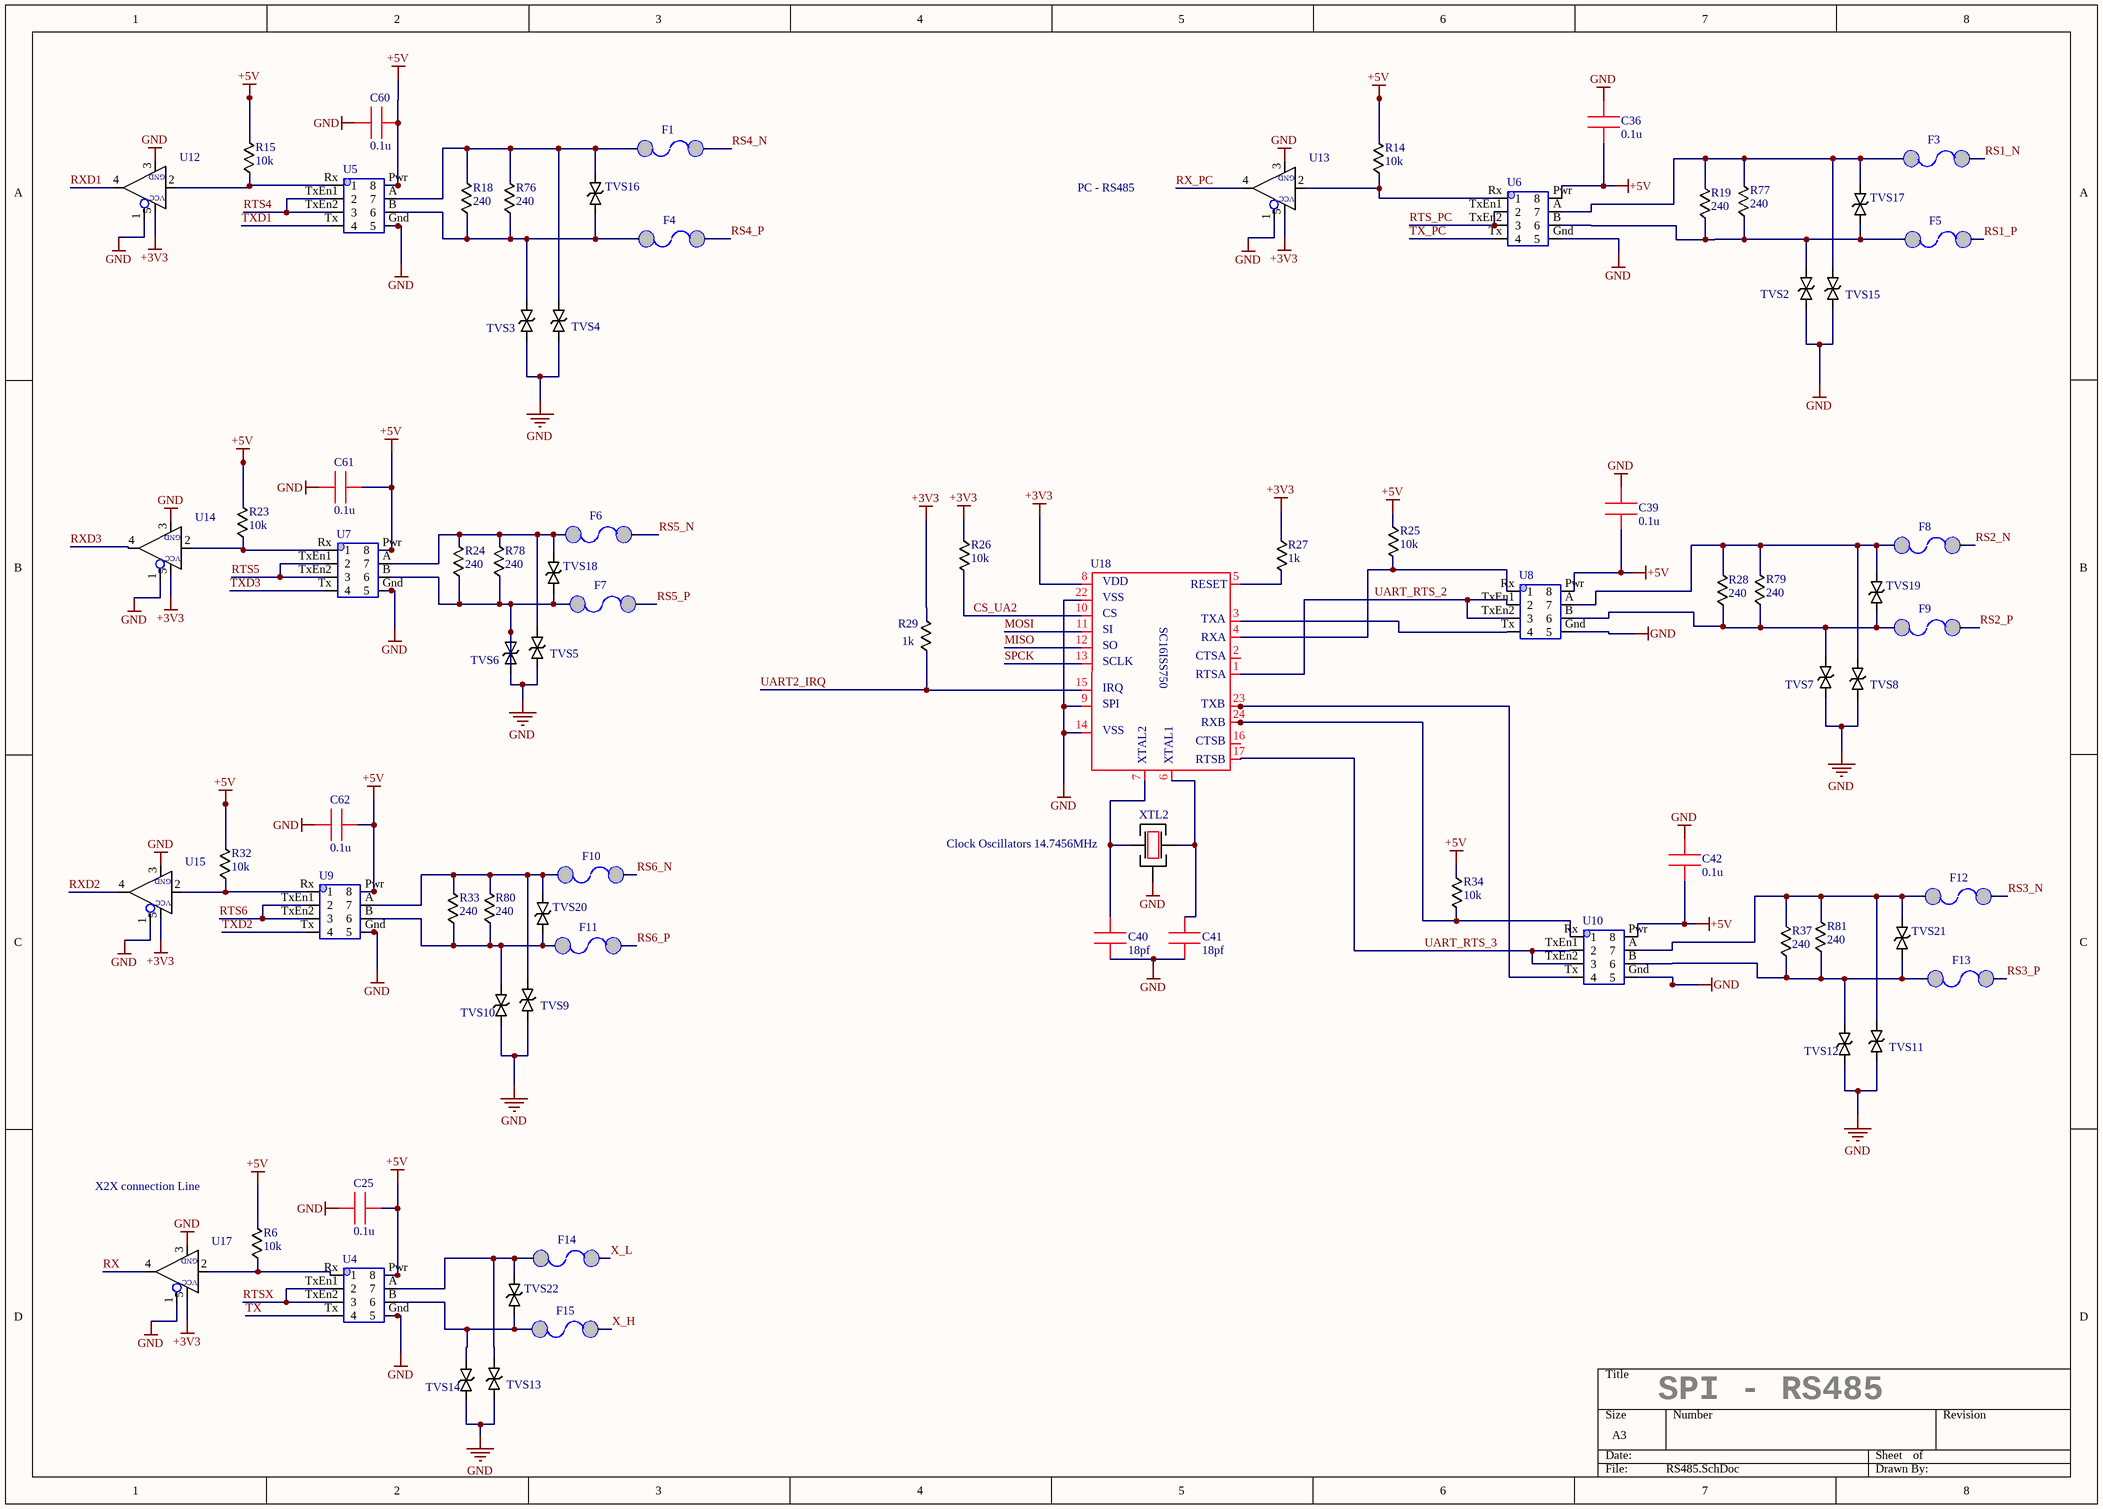
[diagram p6: RS485.SchDoc]

### Parts
C25  0.1u  [0603]
C36  0.1u  [0603]
C39  0.1u  [0603]
C40  18pf  [0603]
C41  18pf  [0603]
C42  0.1u  [0603]
C60  0.1u  [0603]
C61  0.1u  [0603]
C62  0.1u  [0603]
F1  (no value)  [1210]
F3  (no value)  [1210]
F4  (no value)  [1210]
F5  (no value)  [1210]
F6  (no value)  [1210]
F7  (no value)  [1210]
F8  (no value)  [1210]
F9  (no value)  [1210]
F10  (no value)  [1210]
F11  (no value)  [1210]
F12  (no value)  [1210]
F13  (no value)  [1210]
F14  (no value)  [1210]
F15  (no value)  [1210]
R6  10k  [0603]
R14  10k  [0603]
R15  10k  [0603]
R18  240  [0603]
R19  240  [0603]
R23  10k  [0603]
R24  240  [0603]
R25  10k  [0603]
R26  10k  [0603]
R27  1k  [0603]
R28  240  [0603]
R29  1k  [0603]
R32  10k  [0603]
R33  240  [0603]
R34  10k  [0603]
R37  240  [0603]
R76  240  [0603]
R77  240  [0603]
R78  240  [0603]
R79  240  [0603]
R80  240  [0603]
R81  240  [0603]
TVS2  (no value)  [DO-214AC]
TVS3  (no value)  [DO-214AC]
TVS4  (no value)  [DO-214AC]
TVS5  (no value)  [DO-214AC]
TVS6  (no value)  [DO-214AC]
TVS7  (no value)  [DO-214AC]
TVS8  (no value)  [DO-214AC]
TVS9  (no value)  [DO-214AC]
TVS10  (no value)  [DO-214AC]
TVS11  (no value)  [DO-214AC]
TVS12  (no value)  [DO-214AC]
TVS13  (no value)  [DO-214AC]
TVS14  (no value)  [DO-214AC]
TVS15  (no value)  [DO-214AC]
TVS16  (no value)  [DO-214AC]
TVS17  (no value)  [DO-214AC]
TVS18  (no value)  [DO-214AC]
TVS19  (no value)  [DO-214AC]
TVS20  (no value)  [DO-214AC]
TVS21  (no value)  [DO-214AC]
TVS22  (no value)  [DO-214AC]
U4  (no value)  [MAX485 - duplicate]
U5  (no value)  [MAX485 - duplicate]
U6  (no value)  [MAX485 - duplicate]
U7  (no value)  [MAX485 - duplicate]
U8  (no value)  [MAX485 - duplicate]
U9  (no value)  [MAX485 - duplicate]
U10  (no value)  [MAX485 - duplicate]
U12  (no value)  [SOT23 - 5 lead]
U13  (no value)  [SOT23 - 5 lead]
U14  (no value)  [SOT23 - 5 lead]
U15  (no value)  [SOT23 - 5 lead]
U17  (no value)  [SOT23 - 5 lead]
U18  (no value)  [TSSOP28]
XTL2  Part Description: Clock Oscillators 14.7456MHz  [KX-7 XTAL]

### Nets
+3V3: R26.1 R27.1 R29.2 U12.5 U13.5 U14.5 U15.5 U17.5 U18.8
+5V: C25.2 C36.2 C39.2 C42.2 C60.2 C61.2 C62.2 R6.2 R14.2 R15.2 R23.2 R25.1 R32.2 R34.1 U4.Pwr(8) U5.Pwr(8) U6.Pwr(8) U7.Pwr(8) U8.Pwr(8) U9.Pwr(8) U10.Pwr(8)
GND: C25.1 C36.1 C39.1 C40.1 C41.1 C42.1 C60.1 C61.1 C62.1 TVS2.1 TVS3.1 TVS4.1 TVS5.1 TVS6.1 TVS7.1 TVS8.1 TVS9.1 TVS10.1 TVS11.1 TVS12.1 TVS13.1 TVS14.1 TVS15.1 U4.Gnd(5) U5.Gnd(5) U6.Gnd(5) U7.Gnd(5) U8.Gnd(5) U9.Gnd(5) U10.Gnd(5) U12.1 U12.3 U13.1 U13.3 U14.1 U14.3 U15.1 U15.3 U17.1 U17.3 U18.9 U18.14 U18.22 XTL2.2
CS_UA2: R26.2 U18.10
MISO: U18.12
MOSI: U18.11
RS1_N: F3.1
RS1_P: F5.1
RS2_N: F8.1
RS2_P: F9.1
RS3_N: F12.1
RS3_P: F13.1
RS4_N: F1.1
RS4_P: F4.1
RS5_N: F6.1
RS5_P: F7.1
RS6_N: F10.1
RS6_P: F11.1
RTS4: U5.TxEn1(2) U5.TxEn2(3)
RTS5: U7.TxEn1(2) U7.TxEn2(3)
RTS6: U9.TxEn1(2) U9.TxEn2(3)
RTS_PC: U6.TxEn1(2) U6.TxEn2(3)  [project net AD7]
RTSX: U4.TxEn1(2) U4.TxEn2(3)
RX: U17.4
RX_PC: U13.4  [project net AD9]
RXD1: U12.4
RXD2: U15.4
RXD3: U14.4
SPCK: U18.13
TX: U4.Tx(4)
TX_PC: U6.Tx(4)  [project net AD4]
TXD1: U5.Tx(4)
TXD2: U9.Tx(4)
TXD3: U7.Tx(4)
UART2_IRQ: R29.1 U18.15
UART_RTS_2: U8.TxEn1(2) U8.TxEn2(3) U18.1
UART_RTS_3: U10.TxEn1(2) U10.TxEn2(3) U18.17
X_H: F15.1
X_L: F14.1
NetC40_2: C40.2 U18.7 XTL2.1
NetC41_2: C41.2 U18.6 XTL2.3
NetF1_2: F1.2 R18.2 R76.2 TVS4.2 TVS16.2 U5.A(7)
NetF3_2: F3.2 R19.2 R77.2 TVS15.2 TVS17.2 U6.A(7)
NetF4_2: F4.2 R18.1 R76.1 TVS3.2 TVS16.1 U5.B(6)
NetF5_2: F5.2 R19.1 R77.1 TVS2.2 TVS17.1 U6.B(6)
NetF6_2: F6.2 R24.2 R78.2 TVS5.2 TVS18.2 U7.A(7)
NetF7_2: F7.2 R24.1 R78.1 TVS6.2 TVS18.1 U7.B(6)
NetF8_2: F8.2 R28.2 R79.2 TVS8.2 TVS19.2 U8.A(7)
NetF9_2: F9.2 R28.1 R79.1 TVS7.2 TVS19.1 U8.B(6)
NetF10_2: F10.2 R33.2 R80.2 TVS9.2 TVS20.2 U9.A(7)
NetF11_2: F11.2 R33.1 R80.1 TVS10.2 TVS20.1 U9.B(6)
NetF12_2: F12.2 R37.2 R81.2 TVS11.2 TVS21.2 U10.A(7)
NetF13_2: F13.2 R37.1 R81.1 TVS12.2 TVS21.1 U10.B(6)
NetF14_2: F14.2 TVS13.2 TVS22.2 U4.A(7)
NetF15_2: F15.2 TVS14.2 TVS22.1 U4.B(6)
NetR6_1: R6.1 U4.Rx(1) U17.2
NetR14_1: R14.1 U6.Rx(1) U13.2
NetR15_1: R15.1 U5.Rx(1) U12.2
NetR23_1: R23.1 U7.Rx(1) U14.2
NetR25_2: R25.2 U8.Rx(1) U18.4
NetR27_2: R27.2 U18.5
NetR32_1: R32.1 U9.Rx(1) U15.2
NetR34_2: R34.2 U10.Rx(1) U18.24
NetU8_Tx: U8.Tx(4) U18.3
NetU10_Tx: U10.Tx(4) U18.23

Not connected (* = marked no-connect by the designer): U18 2 16

### Notes on the sheet
- PC - RS485
- X2X connection Line
- SPI - RS485
- (in symbol Gate) GND; VCC
- (in symbol SC16IS752) VDD; RESET; VSS; CS; SC16ISS750; TXA; SI; RXA; SO; SCLK; CTSA; RTSA; IRQ; SPI; TXB; RXB; CTSB; XTAL2; XTAL1; RTSB

### Library data of the parts
C25 C36 C39 C42 C60-C62 = Capasitor 0805: as C3 on sheet Processor
C40 C41 = Capasitor 0805: as C17 on sheet Processor
F1 F3-F15 = Fuse PTS: Part Description: PPTC 30V 50MA; Part Number: MF-USMF005-2
R6 R14 R15 R23 R25 R26 R32 R34 = Resistor 0805: as R2 on sheet Processor
R18 R19 R24 R28 R33 R37 R76-R81 = Resistor 0805: as R30 on sheet Processor
R27 R29 = Resistor 0805: as R10 on sheet Power Supply
TVS2-TVS15 = SMAJ5.0CA: Part Description: ESD Protection Diodes 5V; Part Number: SMAJ5.0CA
TVS16-TVS22 = TVS: Part Description: ESD Protection Diodes 5V; Part Number: SMAJ5.0CA
U4-U10 = MAX485: Part Description: RS-485 Interface IC Low-Power; Part Number: SN65HVD3082EDR
U12-U15 U17 = Gate: Part Description: SINGLE BUS BUFFER GATE; Part Number: SN74LVC1G125DBVR
U18 = SC16IS752: Part Description: UART Interface IC I2C/SPI; Part Number: SC16IS752IPW,128
XTL2 = KX-7: Part Number: Geyer KX-7 14.7456MHz

## Sheet ETH_HMI.SchDoc
size A3
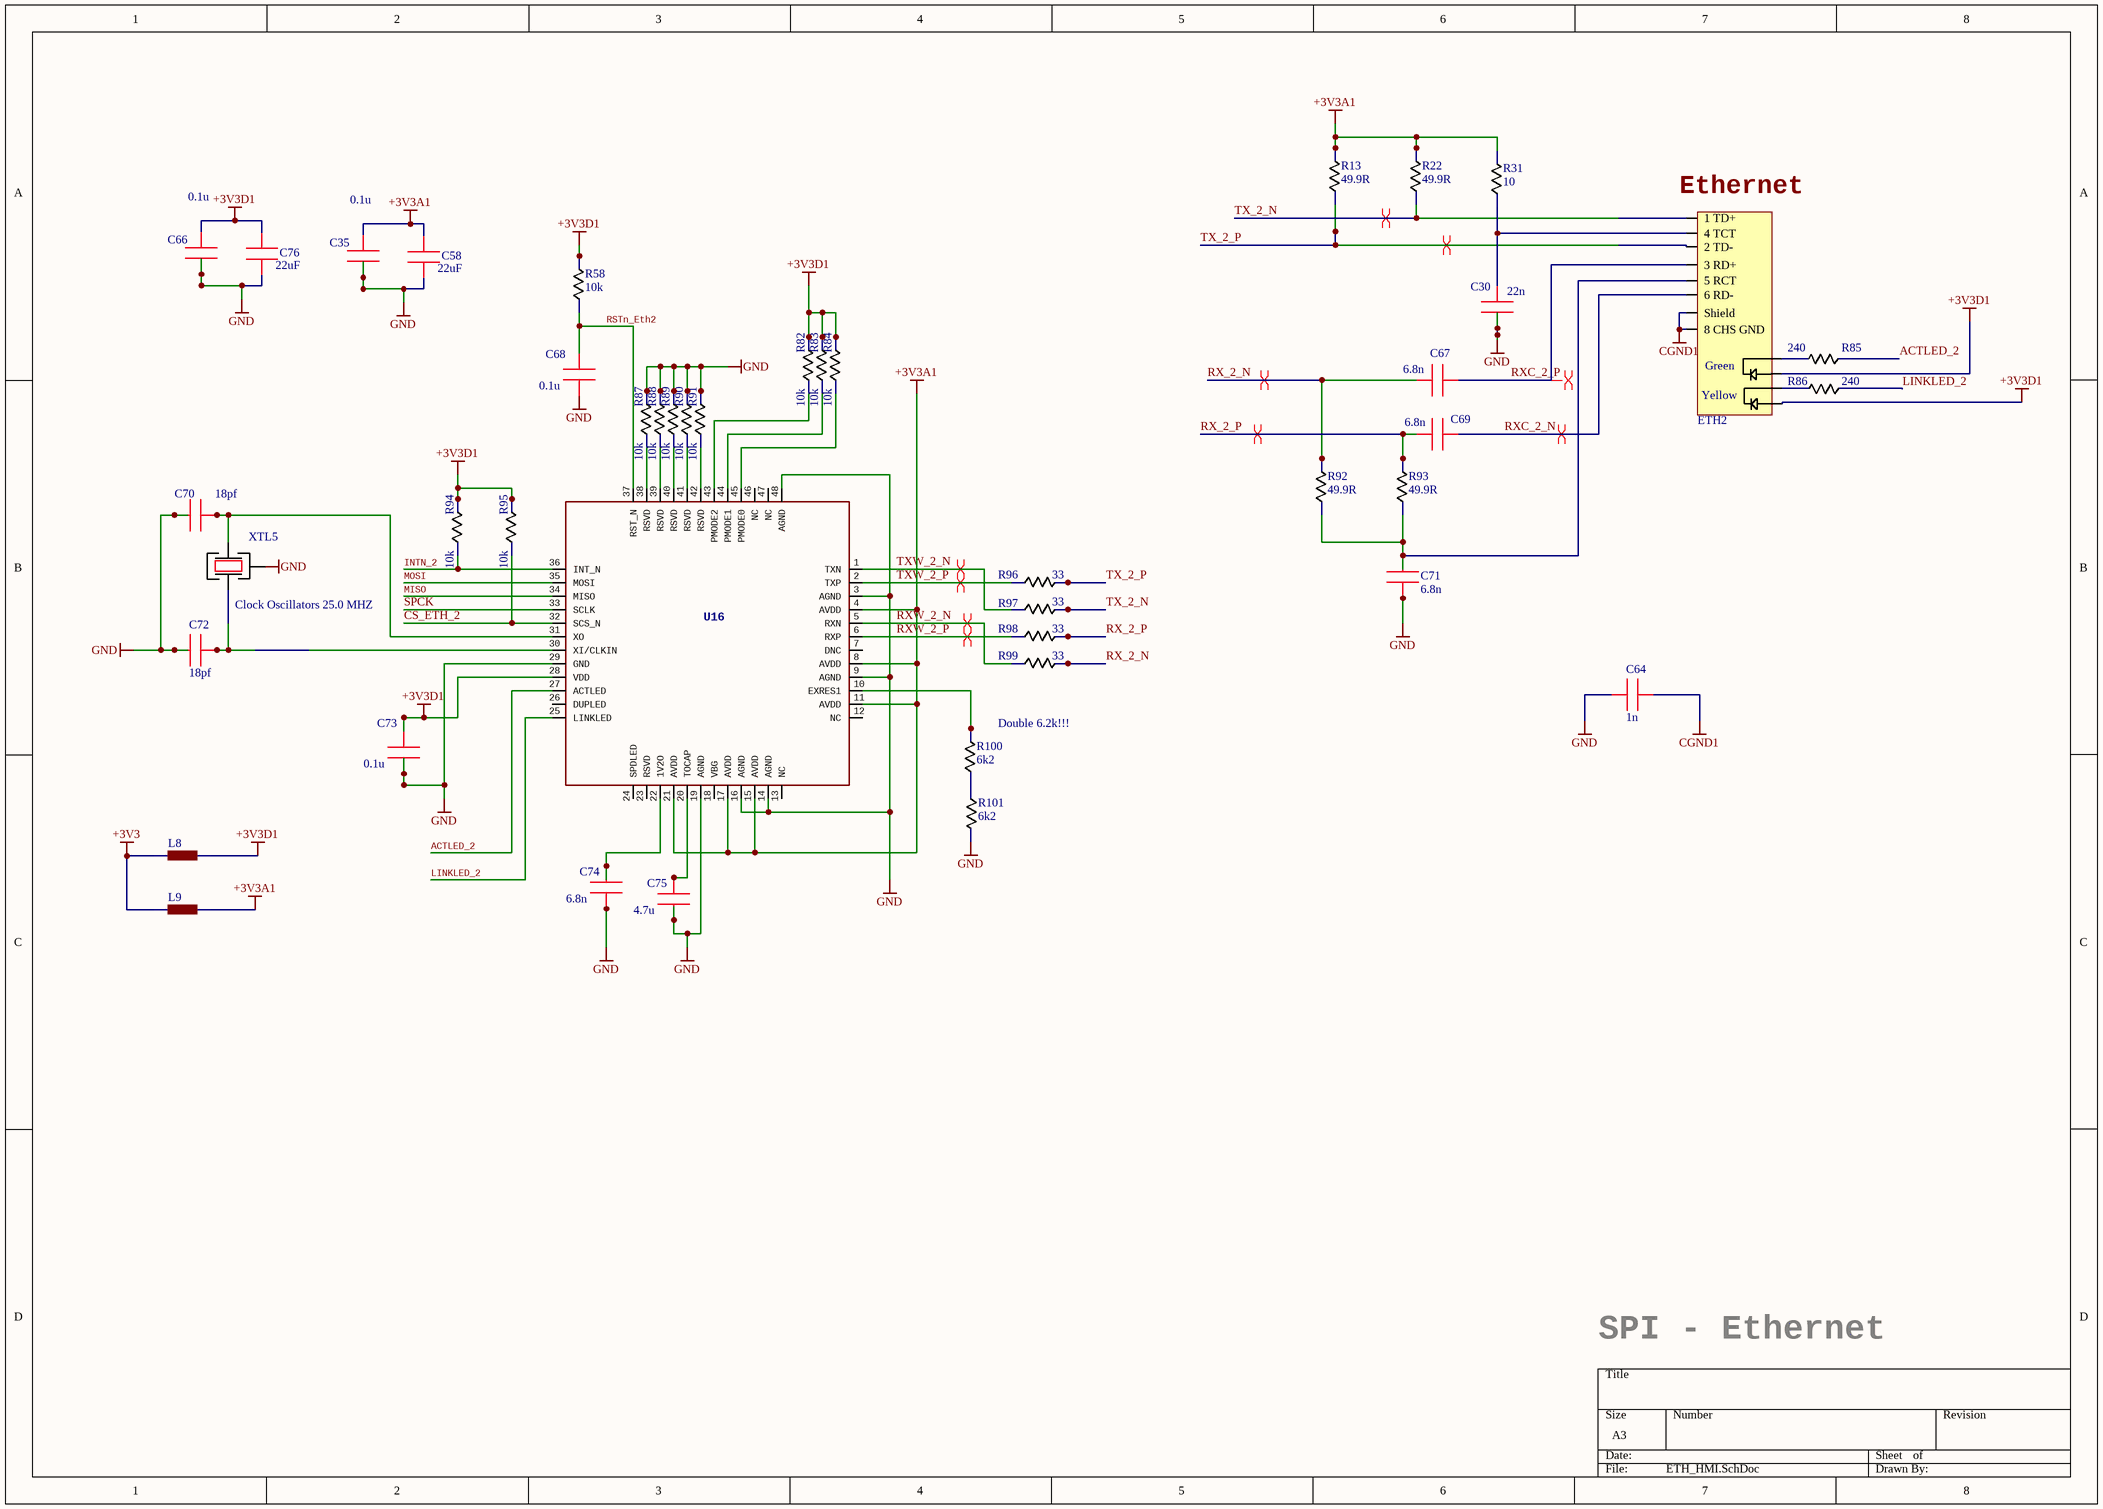
[diagram p7: ETH_HMI.SchDoc]

### Parts
C30  22n  [0603]
C35  0.1u  [0603]
C58  22uF  [1206]
C64  1n  [1206]
C66  0.1u  [0603]
C67  6.8n  [0603]
C68  0.1u  [0603]
C69  6.8n  [0603]
C70  18pf  [0603]
C71  6.8n  [0603]
C72  18pf  [0603]
C73  0.1u  [0603]
C74  6.8n  [0603]
C75  4.7u  [0603]
C76  22uF  [1206]
ETH2  (no value)  [RJ45]
L8  (no value)  [0805]
L9  (no value)  [0805]
R13  49.9R  [0603]
R22  49.9R  [0603]
R31  10  [0603]
R58  10k  [0603]
R82  10k  [0603]
R83  10k  [0603]
R84  10k  [0603]
R85  240  [0603]
R86  240  [0603]
R87  10k  [0603]
R88  10k  [0603]
R89  10k  [0603]
R90  10k  [0603]
R91  10k  [0603]
R92  49.9R  [0603]
R93  49.9R  [0603]
R94  10k  [0603]
R95  10k  [0603]
R96  33  [0603]
R97  33  [0603]
R98  33  [0603]
R99  33  [0603]
R100  6k2  [0603]
R101  6k2  [0603]
U16  (no value)  [LQFP 48]
XTL5  Part Description: Clock Oscillators 25.0 MHZ  [KX-7 XTAL]

### Nets
+3V3: L8.1 L9.1
+3V3A1: C35.1 C58.2 L9.2 R13.2 R22.2 R31.2 U16.4(AVDD) U16.8(AVDD) U16.11(AVDD) U16.15(AVDD) U16.17(AVDD) U16.21(AVDD)
+3V3D1: C66.1 C73.1 C76.2 ETH2.9(LDGr) ETH2.12(LDYE) L8.2 R58.2 R82.2 R83.2 R84.2 R94.2 R95.2 U16.28(VDD)
CGND1: C64.2 ETH2.8(8_CHS_GND) ETH2.SHIELD(Shield)
GND: C30.2 C35.2 C58.1 C64.1 C66.2 C68.2 C70.1 C71.2 C72.1 C73.2 C74.2 C75.2 C76.1 R87.2 R88.2 R89.2 R90.2 R91.2 R101.2 U16.3(AGND) U16.9(AGND) U16.14(AGND) U16.16(AGND) U16.19(AGND) U16.29(GND) U16.48(AGND) XTL5.2
ACTLED_2: R85.1 U16.27(ACTLED)
CS_ETH_2: R95.1 U16.32(SCS_N)
INTN_2: R94.1 U16.36(INT_N)
LINKLED_2: R86.1 U16.25(LINKLED)
MISO: U16.34(MISO)
MOSI: U16.35(MOSI)
RSTn_Eth2: C68.1 R58.1 U16.37(RST_N)
RX_2_N: C67.1 R92.2 R99.2
RX_2_P: C69.1 R93.2 R98.2
RXC_2_N: C69.2 ETH2.6(6_RD-)
RXC_2_P: C67.2 ETH2.3(3_RD+)
RXW_2_N: R99.1 U16.5(RXN)
RXW_2_P: R98.1 U16.6(RXP)
SPCK: U16.33(SCLK)
TX_2_N: ETH2.1(1_TD+) R22.1 R97.2
TX_2_P: ETH2.2(2_TD-) R13.1 R96.2
TXW_2_N: R97.1 U16.1(TXN)
TXW_2_P: R96.1 U16.2(TXP)
NetC30_1: C30.1 ETH2.4(4_TCT) R31.1
NetC70_2: C70.2 U16.31(XO) XTL5.3
NetC71_1: C71.1 ETH2.5(5_RCT) R92.1 R93.1
NetC72_2: C72.2 U16.30(XI/CLKIN) XTL5.1
NetC74_1: C74.1 U16.22(1V2O)
NetC75_1: C75.1 U16.20(TOCAP)
NetETH2_10: ETH2.10(LDGr) R85.2
NetETH2_11: ETH2.11(LDYE) R86.2
NetR82_1: R82.1 U16.43(PMODE2)
NetR83_1: R83.1 U16.44(PMODE1)
NetR84_1: R84.1 U16.45(PMODE0)
NetR87_1: R87.1 U16.38(RSVD)
NetR88_1: R88.1 U16.39(RSVD)
NetR89_1: R89.1 U16.40(RSVD)
NetR90_1: R90.1 U16.41(RSVD)
NetR91_1: R91.1 U16.42(RSVD)
NetR100_1: R100.1 R101.1
NetR100_2: R100.2 U16.10(EXRES1)

Not connected (* = marked no-connect by the designer): U16 7(DNC) 12(NC) 13(NC) 18(VBG) 23(RSVD) 24(SPDLED) 26(DUPLED) 46(NC) 47(NC)

### Layout directives
differential pair: RX_2_N, RX_2_P, RXC_2_N, RXC_2_P, RXW_2_N, RXW_2_P, TX_2_N, TX_2_P, TXW_2_N, TXW_2_P

### Notes on the sheet
- (near ETH2) Ethernet
- (near R100) Double 6.2k!!!
- SPI - Ethernet
- (in symbol J0011D21BNL) Green; Yellow

### Library data of the parts
C30 = 0603 CAP: as C45 on sheet Ethernet
C35 C66 C68 C73 = 0603 CAP: as C29 on sheet Ethernet
C58 C76 = 0805 Cap: Part Description: 16V 22uF X5R 1206 10%; Part Number: CC206KKX5R7BB226
C64 = 0603 CAP: as C80 on sheet Ethernet
C67 C69 C71 C74 = 0603 CAP: as C26 on sheet Processor
C70 C72 = 0603 CAP: as C51 on sheet Ethernet
C75 = 0603 CAP: as C56 on sheet Ethernet
ETH2 = J0011D21BNL: Part Description: RJ45 MagJack; Part Number: J0011D21BNL
L8 L9 = BLM21PG220SN1D: as L1 on sheet Processor
R13 R22 R92 R93 = 0603 RES: as R40 on sheet Ethernet
R31 = 0603 RES: as R42 on sheet Ethernet
R58 R82-R84 R87-R91 R94 R95 = 0603 RES: as R43 on sheet Ethernet
R85 R86 = 0603 RES: as R44 on sheet Ethernet
R96-R99 = 0603 RES: as R59 on sheet Ethernet
R100 = 0603 RES: as R63 on sheet Ethernet
R101 = Resistor 0805: as R5 on sheet Processor
U16 = W5500: as U11 on sheet Ethernet; Part Number: W5500
XTL5 = KX-7: Part Number: Geyer KX-7 25.0 MHz

## Nets that join several sheets
+3V3: Processor (14 pins), Power Supply (C24.2 C32.1 U3.2), LEDs (R69.2), Ethernet (L6.1 L7.1), SD Holder (C57.2 R74.1 SD1.4 SD1.SWA), RS485 (9 pins), ETH_HMI (L8.1 L9.1)
+5V: Power Supply (7 pins), LEDs (7 pins), RS485 (21 pins)
+24V: Power Supply (F2.2), Plugs (P3.4)
GND: Processor (38 pins), Power Supply (16 pins), LEDs (10 pins), Plugs (J1.0 J1.4 P3.5), Ethernet (31 pins), SD Holder (C57.1 SD1.6), RS485 (44 pins), ETH_HMI (27 pins)
AD4: Processor (U1.J12), RS485 (U6.Tx)
AD7: Processor (U1.H12), LEDs (R16.2), RS485 (U6.TxEn1 U6.TxEn2)
AD9: Processor (U1.G12), RS485 (U13.4)
CS_ETH: Processor (U1.c12), Ethernet (R57.1 U11.32)
CS_ETH_2: Processor (U1.G9), ETH_HMI (R95.1 U16.32)
CS_SD: Processor (U1.D5), SD Holder (R74.2 SD1.2)
CS_UA2: Processor (U1.D7), RS485 (R26.2 U18.10)
D+_P: Processor (R4.2 U1.L1 Z1.1), Plugs (J1.3)
D-_N: Processor (R3.2 U1.L2 Z2.1), Plugs (J1.2)
INTN: Processor (U1.C3), Ethernet (R56.1 U11.36)
INTN_2: Processor (U1.G8), ETH_HMI (R94.1 U16.36)
MISO: Processor (U1.B12), Ethernet (U11.34), SD Holder (SD1.7), RS485 (U18.12), ETH_HMI (U16.34)
MOSI: Processor (U1.B11), Ethernet (U11.35), SD Holder (SD1.3), RS485 (U18.11), ETH_HMI (U16.35)
PLC_OK: Processor (U1.M9), LEDs (R70.2)
RS1_N: Plugs (P1.2), RS485 (F3.1)
RS1_P: Plugs (P1.1), RS485 (F5.1)
RS2_N: Plugs (P1.4), RS485 (F8.1)
RS2_P: Plugs (P1.3), RS485 (F9.1)
RS3_N: Plugs (P1.6), RS485 (F12.1)
RS3_P: Plugs (P1.5), RS485 (F13.1)
RS4_N: Plugs (P1.8), RS485 (F1.1)
RS4_P: Plugs (P1.7), RS485 (F4.1)
RS5_N: Plugs (P1.10), RS485 (F6.1)
RS5_P: Plugs (P1.9), RS485 (F7.1)
RS6_N: Plugs (P1.12), RS485 (F10.1)
RS6_P: Plugs (P1.11), RS485 (F11.1)
RSTn_Eth1: Processor (U1.F1), Ethernet (C49.1 R43.1 U11.37)
RSTn_Eth2: Processor (U1.D12), ETH_HMI (C68.1 R58.1 U16.37)
RTS4: Processor (U1.B5), LEDs (R73.2), RS485 (U5.TxEn1 U5.TxEn2)
RTS5: Processor (U1.C6), LEDs (R110.2), RS485 (U7.TxEn1 U7.TxEn2)
RTS6: Processor (U1.C5), LEDs (R107.2), RS485 (U9.TxEn1 U9.TxEn2)
RTSX: Processor (U1.E10), RS485 (U4.TxEn1 U4.TxEn2)
RX: Processor (U1.G3), RS485 (U17.4)
RXD1: Processor (U1.B1), RS485 (U12.4)
RXD2: Processor (U1.C2), RS485 (U15.4)
RXD3: Processor (U1.E5), RS485 (U14.4)
SD_Detect: Processor (U1.D2), SD Holder (SD1.SWB)
SD_OK: Processor (U1.L9), LEDs (R72.2)
SPCK: Processor (U1.A12), Ethernet (U11.33), SD Holder (SD1.5), RS485 (U18.13), ETH_HMI (U16.33)
TX: Processor (U1.A1), RS485 (U4.Tx)
TXD1: Processor (U1.D3), RS485 (U5.Tx)
TXD2: Processor (U1.C1), RS485 (U9.Tx)
TXD3: Processor (U1.E4), RS485 (U7.Tx)
UART2_IRQ: Processor (U1.E2), RS485 (R29.1 U18.15)
UART_RTS_2: LEDs (R66.2), RS485 (U8.TxEn1 U8.TxEn2 U18.1)
UART_RTS_3: LEDs (R68.2), RS485 (U10.TxEn1 U10.TxEn2 U18.17)
X2X_Led: Processor (U1.D4), LEDs (R104.2)
X_H: Plugs (P3.2), RS485 (F15.1)
X_L: Plugs (P3.1), RS485 (F14.1)
XUSB: Processor (U1.M4), Plugs (J1.1)